# EAGLE design MJ808 clone - rev.5 - TCAN334 - SN E3 - prod (EAGLE 9.6.2)
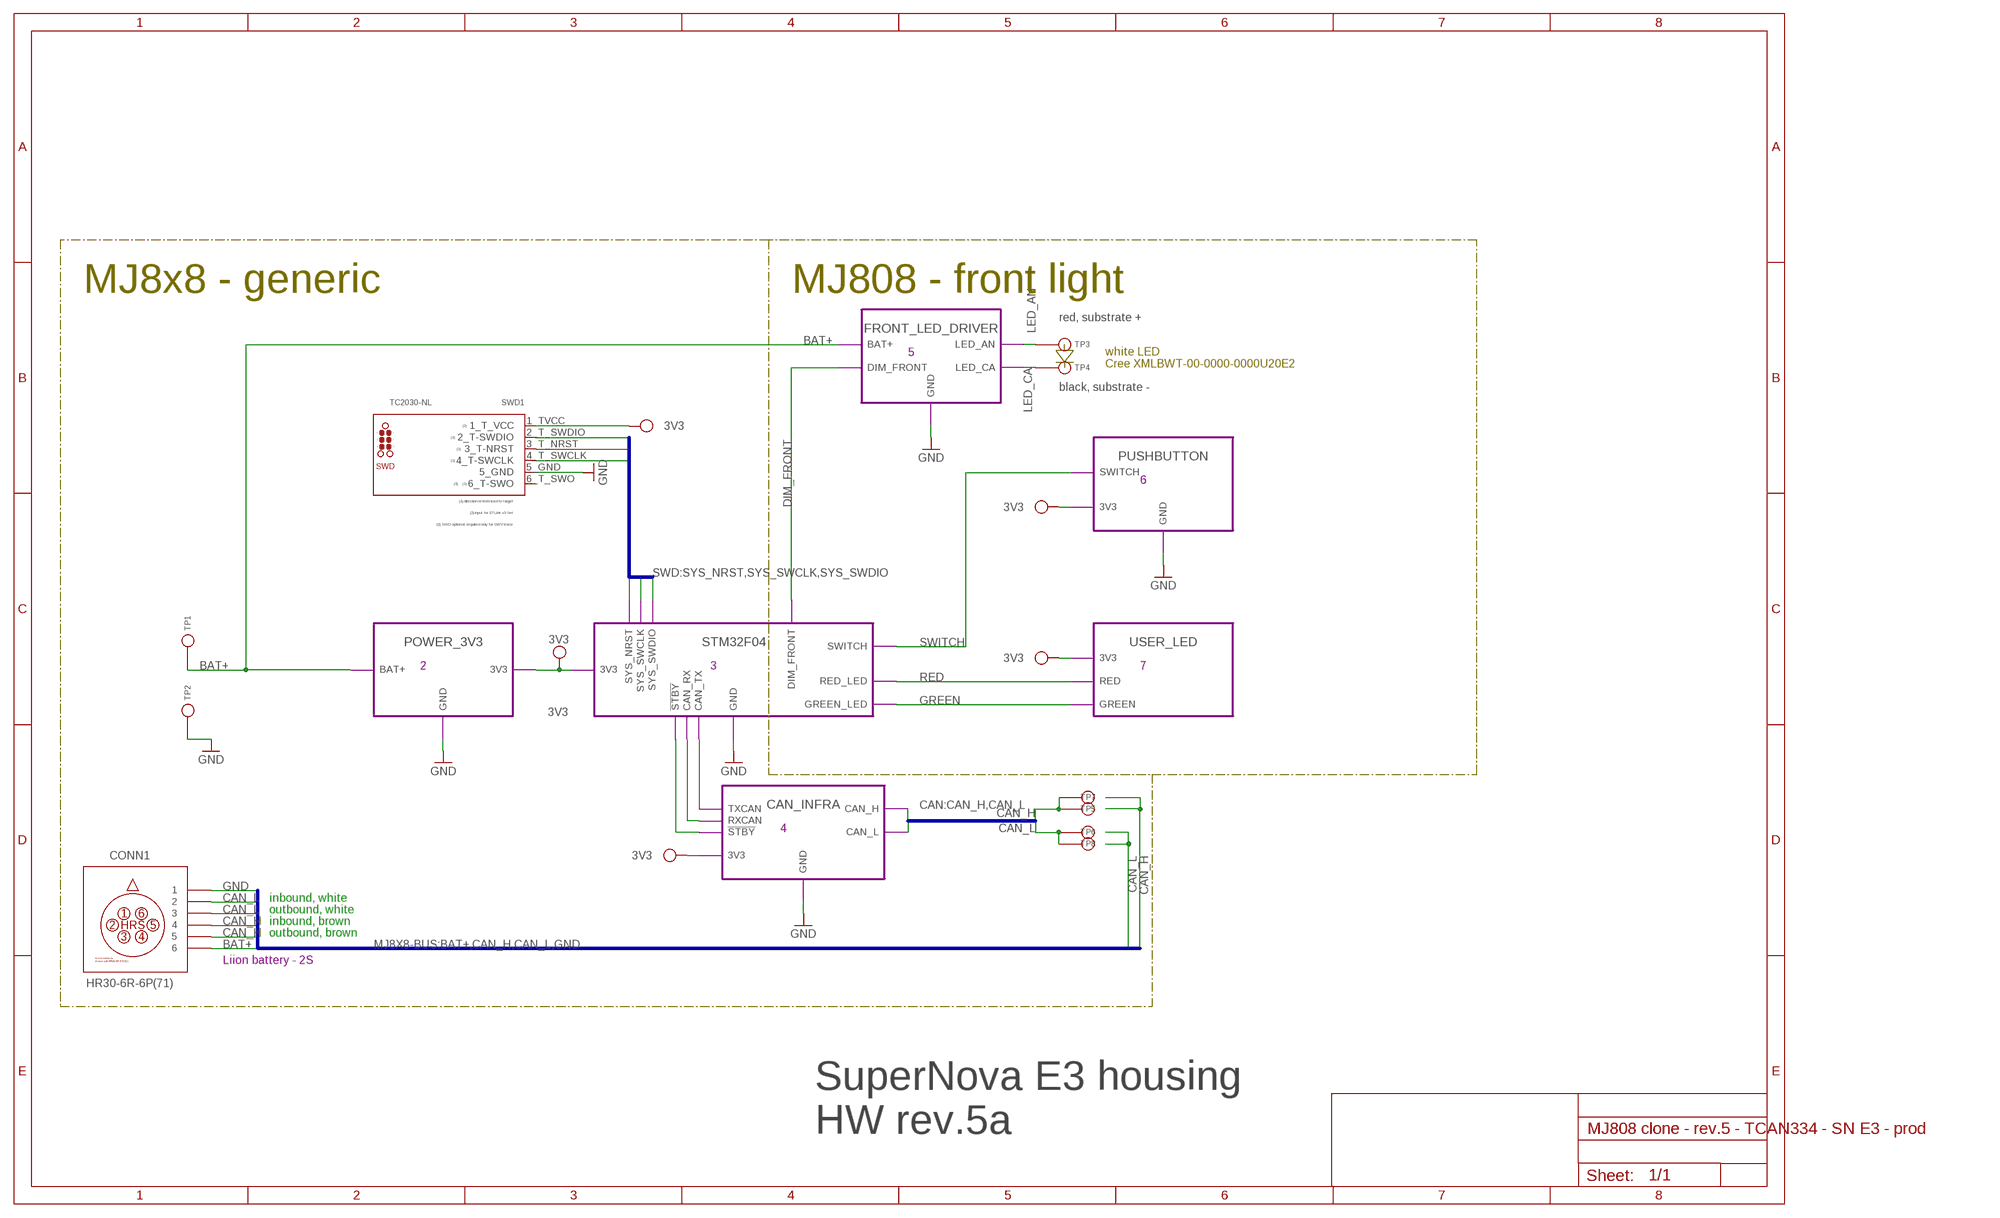
[diagram p0: schematic, sheet 1]

## Parts
CONN1  HR30-6R-6P(71)  HR-30-6R-6X  (no package)
SWD1  TC2030-NL  TC2030  [TC2030-NL]
TP1  LiIon + Terminal  TPTH-0.9  [TH-0.9]
TP2  LiIon - Terminal  TPTH-0.9  [TH-0.9]
TP3  LED anode  TPTH-0.9  [TH-0.9]
TP4  LED cathode  TPTH-0.9  [TH-0.9]
TP5  CAN high  TPTH-0.9  [TH-0.9]
TP6  CAN low  TPTH-0.9  [TH-0.9]
TP7  CAN high  TPTH-0.9  [TH-0.9]
TP8  CAN low  TPTH-0.9  [TH-0.9]

## Module instances
POWER_3V3 = POWER_3V3 (part numbers offset by 200)
STM32F04 = STM32 (part numbers offset by 300)
CAN_INFRA = CAN_INFRA (part numbers offset by 400)
FRONT_LED_DRIVER = LED_DRIVER_FRONT (part numbers offset by 500)
PUSHBUTTON = PUSHBUTTON (part numbers offset by 600)
USER_LED = USER_LED (part numbers offset by 700)

## Nets
3V3 [3V3]: SWD1.1_TVCC(1_T_VCC) ; port STM32F04.3V3 POWER_3V3.3V3 CAN_INFRA.3V3 PUSHBUTTON.3V3 USER_LED.3V3
!STBY! [signal]: port CAN_INFRA.!STBY! STM32F04.!STBY!
BAT+ [BAT+]: CONN1.6 TP1.P$1(TP$1) ; port POWER_3V3.BAT+ FRONT_LED_DRIVER.BAT+
CAN_H [signal]: CONN1.4 CONN1.5 TP5.P$1(TP$1) TP7.P$1(TP$1) ; port CAN_INFRA.CAN_H
CAN_L [signal]: CONN1.2 CONN1.3 TP6.P$1(TP$1) TP8.P$1(TP$1) ; port CAN_INFRA.CAN_L
CAN_RX [signal]: port CAN_INFRA.RXCAN STM32F04.CAN_RX
CAN_TX [signal]: port CAN_INFRA.TXCAN STM32F04.CAN_TX
DIM_FRONT [signal]: port STM32F04.DIM_FRONT FRONT_LED_DRIVER.DIM_FRONT
GND: CONN1.1 SWD1.5_GND TP2.P$1(TP$1) ; port STM32F04.GND POWER_3V3.GND CAN_INFRA.GND FRONT_LED_DRIVER.GND PUSHBUTTON.GND
GREEN [3V3]: port STM32F04.GREEN_LED USER_LED.GREEN
LED_AN [BAT+]: TP3.P$1(TP$1) ; port FRONT_LED_DRIVER.LED_AN
LED_CA [BAT+]: TP4.P$1(TP$1) ; port FRONT_LED_DRIVER.LED_CA
RED [3V3]: port STM32F04.RED_LED USER_LED.RED
SWITCH [signal]: port STM32F04.SWITCH PUSHBUTTON.SWITCH
SYS_NRST [signal]: SWD1.3_T_NRST(3_T-NRST) ; port STM32F04.SYS_NRST
SYS_SWCLK [signal]: SWD1.4_T_SWCLK(4_T-SWCLK) ; port STM32F04.SYS_SWCLK
SYS_SWDIO [signal]: SWD1.2_T_SWDIO(2_T-SWDIO) ; port STM32F04.SYS_SWDIO
Unconnected: SWD1.6_T_SWO(6_T-SWO)

## Buses
CAN:CAN_H,CAN_L
SWD:SYS_NRST,SYS_SWCLK,SYS_SWDIO
MJ8X8-BUS:BAT+,CAN_H,CAN_L,GND

## Notes on the sheet
- MJ8x8 - generic | MJ808 - front light
- red, substrate +
- 5
- white LED
  Cree XMLBWT-00-0000-0000U20E2
- black, substrate -
- 6
- 2 | 3 | 7
- 4
- inbound, white
- outbound, white
- inbound, brown
- outbound, brown
- Liion battery - 2S
- SuperNova E3 housing
  HW rev.5a

## Library data of the parts
CONN1 = HR30-6R-6P - PushPull Receptacle:HR-30-6R-6X
SWD1 = tag-connect:TC2030: TC2030 pad no. Function STLink v3 CN1 pin no. Function 1 Reserved (1) 2 Reserved (1) 1 T_Vcc 3 T_Vcc (2) 2 T_SWDIO 4 T_JTMS/T_SWDIO 5 GND 4 T_SWCLK 6 T_JCLK / T_SWCLK 5 GND 7 GND 6 8 T_JTDO / T_SWO (3) 9 T_JRCLK (4) / NC (5) 10 T_JTDI / NC (5) 11 GNDDetect (6) 3 T_NRST 12 T_NRST 13 T_VCP_RX (7) 14 T_VCP_TX (2) (1) Do not connect to the target (2) Input for STLINK-V3SET (3) SWO is optional, required only for Serial Wire Viewer (SWV) trace (4) Optional loopback of T_JCLK on the target side, required if loopback is removed on the STLINK-V3SET side (5) NC means not required for the SWD connection (6) Tied to GND by STLINK-V3SET firmware; may be used by the target for detection of the tool (7) Output for STLINK-V3SET
TP1-TP8 = signal testpoint:TP

## Module POWER_3V3
Ports: GND(pwr) BAT+(pwr) 3V3(pwr)
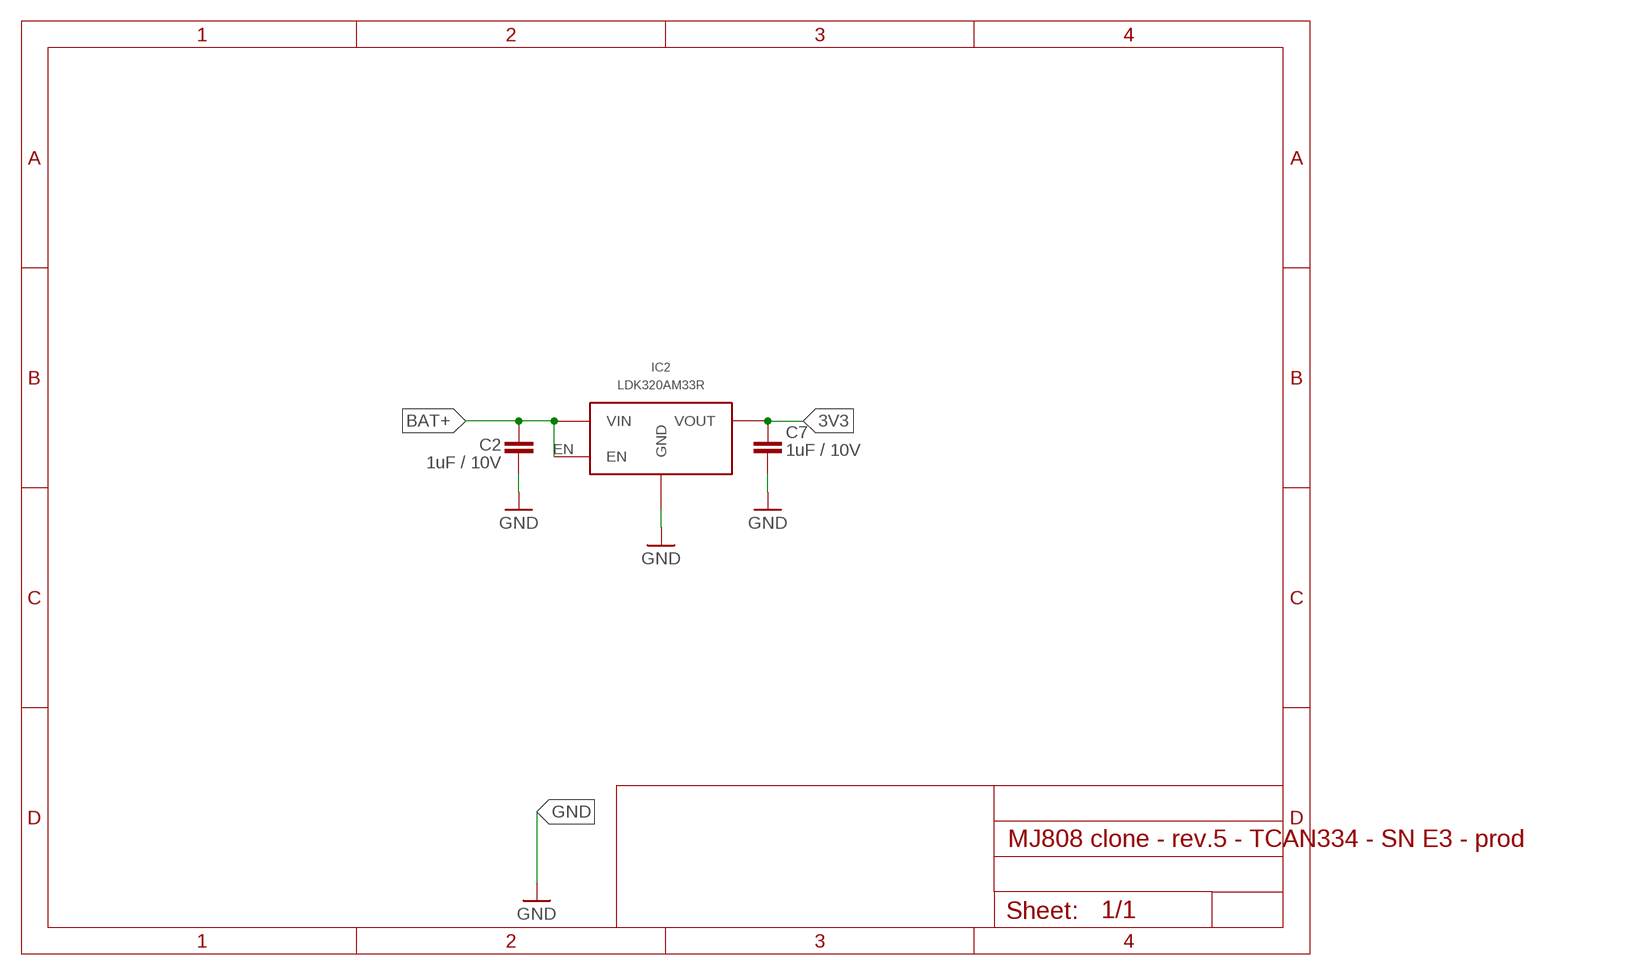
[diagram p1: schematic, module POWER_3V3, sheet 1]

### Parts
C2  1uF / 10V  C-EUC0402  [C0402]
C7  1uF / 10V  C-EUC0402  [C0402]
IC2  LDK320AM33R  LDK320SOT-23-5L  [SOT-23-5L]

### Nets
3V3 [3V3]: C7.2 IC2.OUT(VOUT)
BAT+ [BAT+]: C2.1 IC2.EN IC2.IN(VIN)
GND: C2.2 C7.1 IC2.GND

### Library data of the parts
C2 C7 = rcl:C-EU: CAPACITOR, European symbol; SPICEPREFIX: C
IC2 = LDK320 5V LDO:LDK320

## Module STM32
Ports: GND(pwr) 3V3(pwr) SYS_NRST(in) SYS_SWCLK(io) SYS_SWDIO(io) CAN_RX(in) CAN_TX(out) !STBY!(out) SWITCH(in) GREEN_LED(hiz) RED_LED(hiz) DIM_FRONT(out)
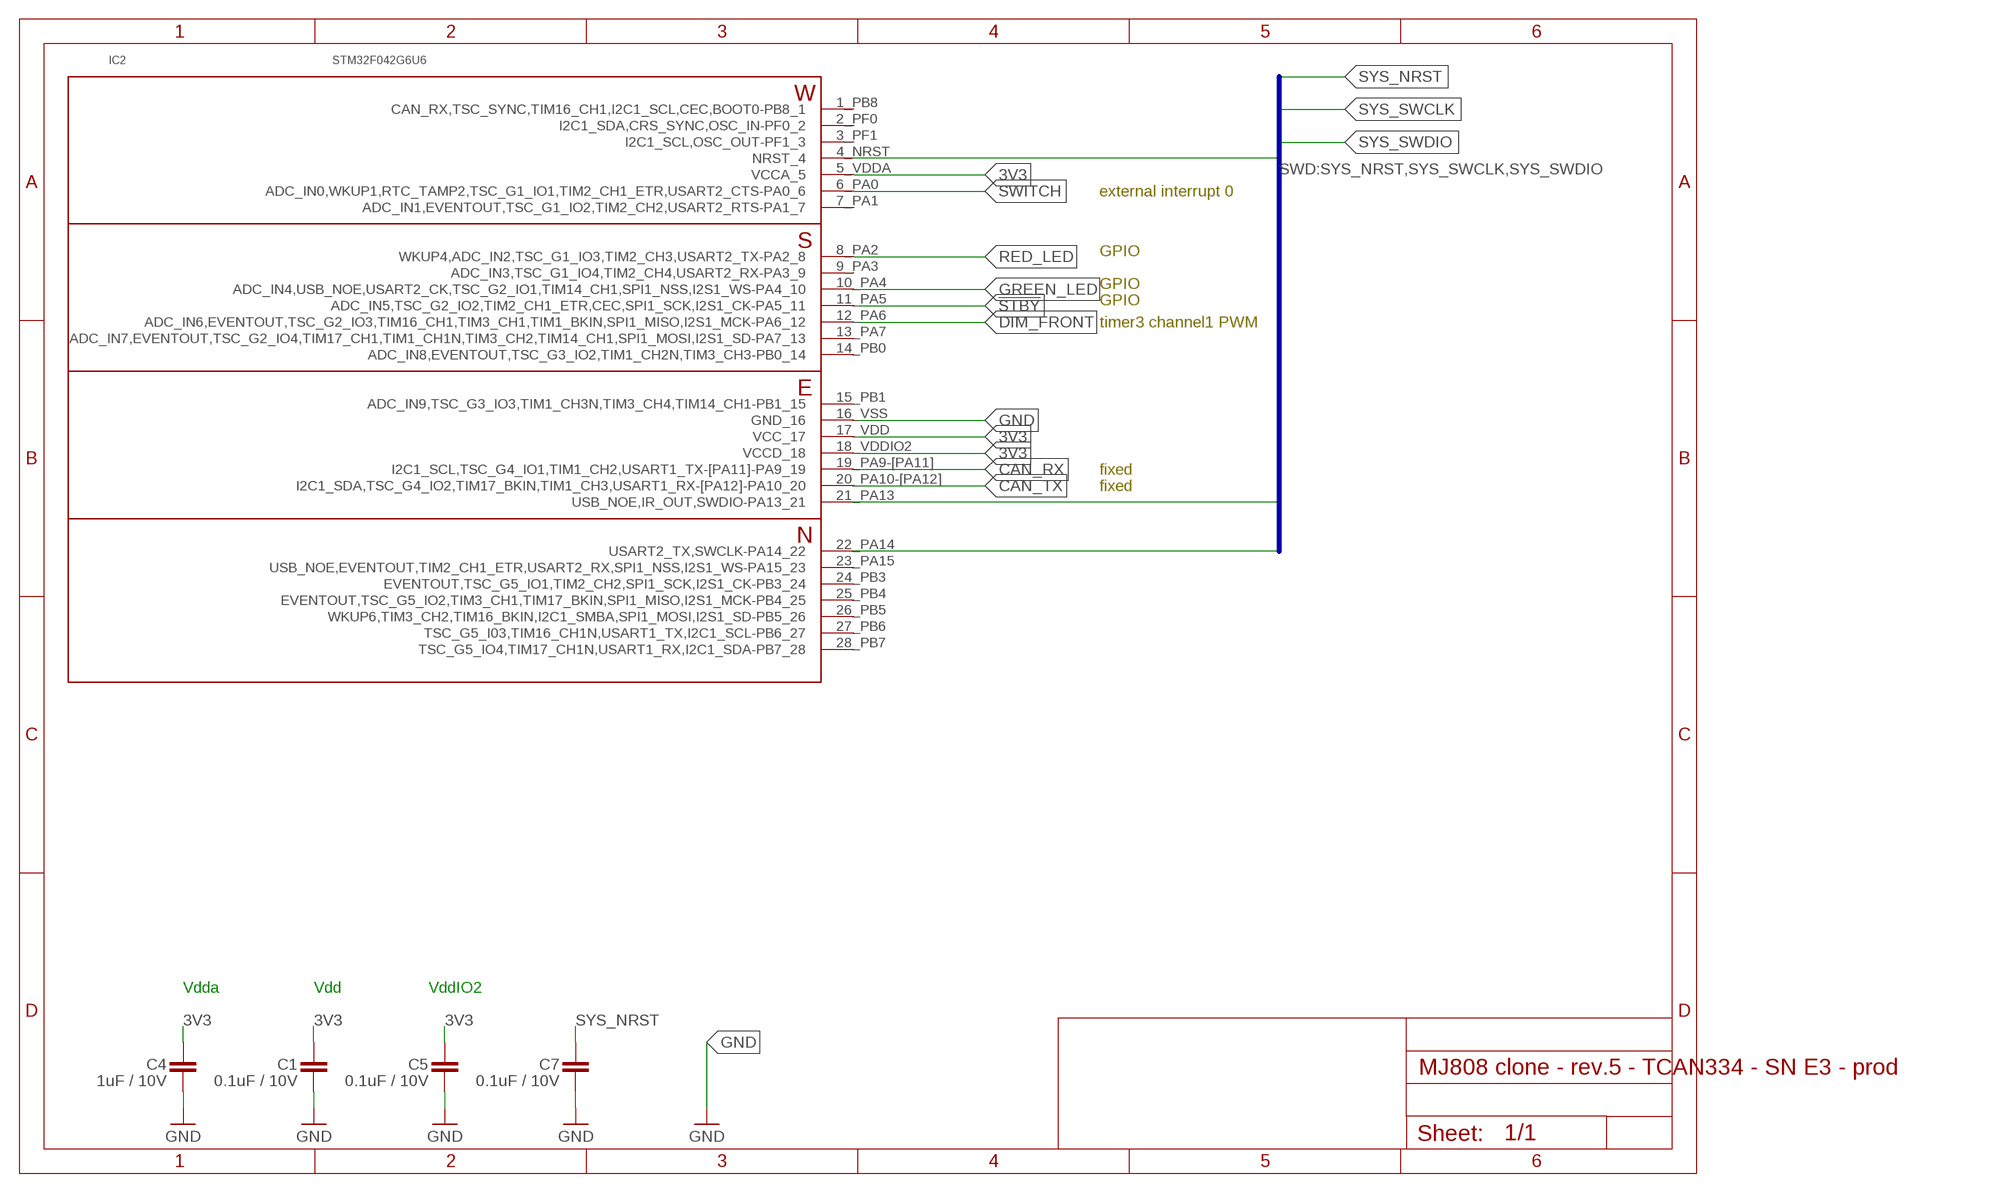
[diagram p2: schematic, module STM32, sheet 1]

### Parts
C1  0.1uF / 10V  C-EUC0402  [C0402]
C4  1uF / 10V  C-EUC0402  [C0402]
C5  0.1uF / 10V  C-EUC0402  [C0402]
C7  0.1uF / 10V  C-EUC0402  [C0402]
IC2  STM32F042G6U6  STM32F042G6  [UFQFPN-28]

### Nets
3V3 [3V3]: C1.2 C4.2 C5.2 IC2.5_VDDA(VCCA_5) IC2.17_VDD(VCC_17) IC2.18_VDDIO2(VCCD_18)
!STBY!: IC2.11_PA5(ADC_IN5,TSC_G2_IO2,TIM2_CH1_ETR,CEC,SPI1_SCK,I2S1_CK-PA5_11)
CAN_RX: IC2.19_PA9-[PA11](I2C1_SCL,TSC_G4_IO1,TIM1_CH2,USART1_TX-[PA11]-PA9_19)
CAN_TX: IC2.20_PA10-[PA12](I2C1_SDA,TSC_G4_IO2,TIM17_BKIN,TIM1_CH3,USART1_RX-[PA12]-PA10_20)
DIM_FRONT: IC2.12_PA6(ADC_IN6,EVENTOUT,TSC_G2_IO3,TIM16_CH1,TIM3_CH1,TIM1_BKIN,SPI1_MISO,I2S1_MCK-PA6_12)
GND: C1.1 C4.1 C5.1 C7.1 IC2.16_VSS(GND_16)
GREEN_LED [3V3]: IC2.10_PA4(ADC_IN4,USB_NOE,USART2_CK,TSC_G2_IO1,TIM14_CH1,SPI1_NSS,I2S1_WS-PA4_10)
RED_LED [3V3]: IC2.8_PA2(WKUP4,ADC_IN2,TSC_G1_IO3,TIM2_CH3,USART2_TX-PA2_8)
SWITCH: IC2.6_PA0(ADC_IN0,WKUP1,RTC_TAMP2,TSC_G1_IO1,TIM2_CH1_ETR,USART2_CTS-PA0_6)
SYS_NRST: C7.2 IC2.4_NRST(NRST_4)
SYS_SWCLK: IC2.22_PA14(USART2_TX,SWCLK-PA14_22)
SYS_SWDIO: IC2.21_PA13(USB_NOE,IR_OUT,SWDIO-PA13_21)
Unconnected: IC2.1_PB8(CAN_RX,TSC_SYNC,TIM16_CH1,I2C1_SCL,CEC,BOOT0-PB8_1) IC2.2_PF0(I2C1_SDA,CRS_SYNC,OSC_IN-PF0_2) IC2.3_PF1(I2C1_SCL,OSC_OUT-PF1_3) IC2.7_PA1(ADC_IN1,EVENTOUT,TSC_G1_IO2,TIM2_CH2,USART2_RTS-PA1_7) IC2.9_PA3(ADC_IN3,TSC_G1_IO4,TIM2_CH4,USART2_RX-PA3_9) IC2.13_PA7(ADC_IN7,EVENTOUT,TSC_G2_IO4,TIM17_CH1,TIM1_CH1N,TIM3_CH2,TIM14_CH1,SPI1_MOSI,I2S1_SD-PA7_13) IC2.14_PB0(ADC_IN8,EVENTOUT,TSC_G3_IO2,TIM1_CH2N,TIM3_CH3-PB0_14) IC2.15_PB1(ADC_IN9,TSC_G3_IO3,TIM1_CH3N,TIM3_CH4,TIM14_CH1-PB1_15) IC2.23_PA15(USB_NOE,EVENTOUT,TIM2_CH1_ETR,USART2_RX,SPI1_NSS,I2S1_WS-PA15_23) IC2.24_PB3(EVENTOUT,TSC_G5_IO1,TIM2_CH2,SPI1_SCK,I2S1_CK-PB3_24) IC2.25_PB4(EVENTOUT,TSC_G5_IO2,TIM3_CH1,TIM17_BKIN,SPI1_MISO,I2S1_MCK-PB4_25) IC2.26_PB5(WKUP6,TIM3_CH2,TIM16_BKIN,I2C1_SMBA,SPI1_MOSI,I2S1_SD-PB5_26) IC2.27_PB6(TSC_G5_I03,TIM16_CH1N,USART1_TX,I2C1_SCL-PB6_27) IC2.28_PB7(TSC_G5_IO4,TIM17_CH1N,USART1_RX,I2C1_SDA-PB7_28)

### Buses
SWD:SYS_NRST,SYS_SWCLK,SYS_SWDIO

### Notes on the sheet
- external interrupt 0
- GPIO
- GPIO
- GPIO
- timer3 channel1 PWM
- fixed
- fixed
- Vdda | Vdd | VddIO2

### Library data of the parts
C1 C4 C5 C7 = rcl:C-EU: CAPACITOR, European symbol; SPICEPREFIX: C
IC2 = STM32F042G6:STM32F042G6

## Module CAN_INFRA
Ports: GND(pwr) 3V3(pwr) CAN_H(io) CAN_L(io) TXCAN(in) RXCAN(out) !STBY!(in)
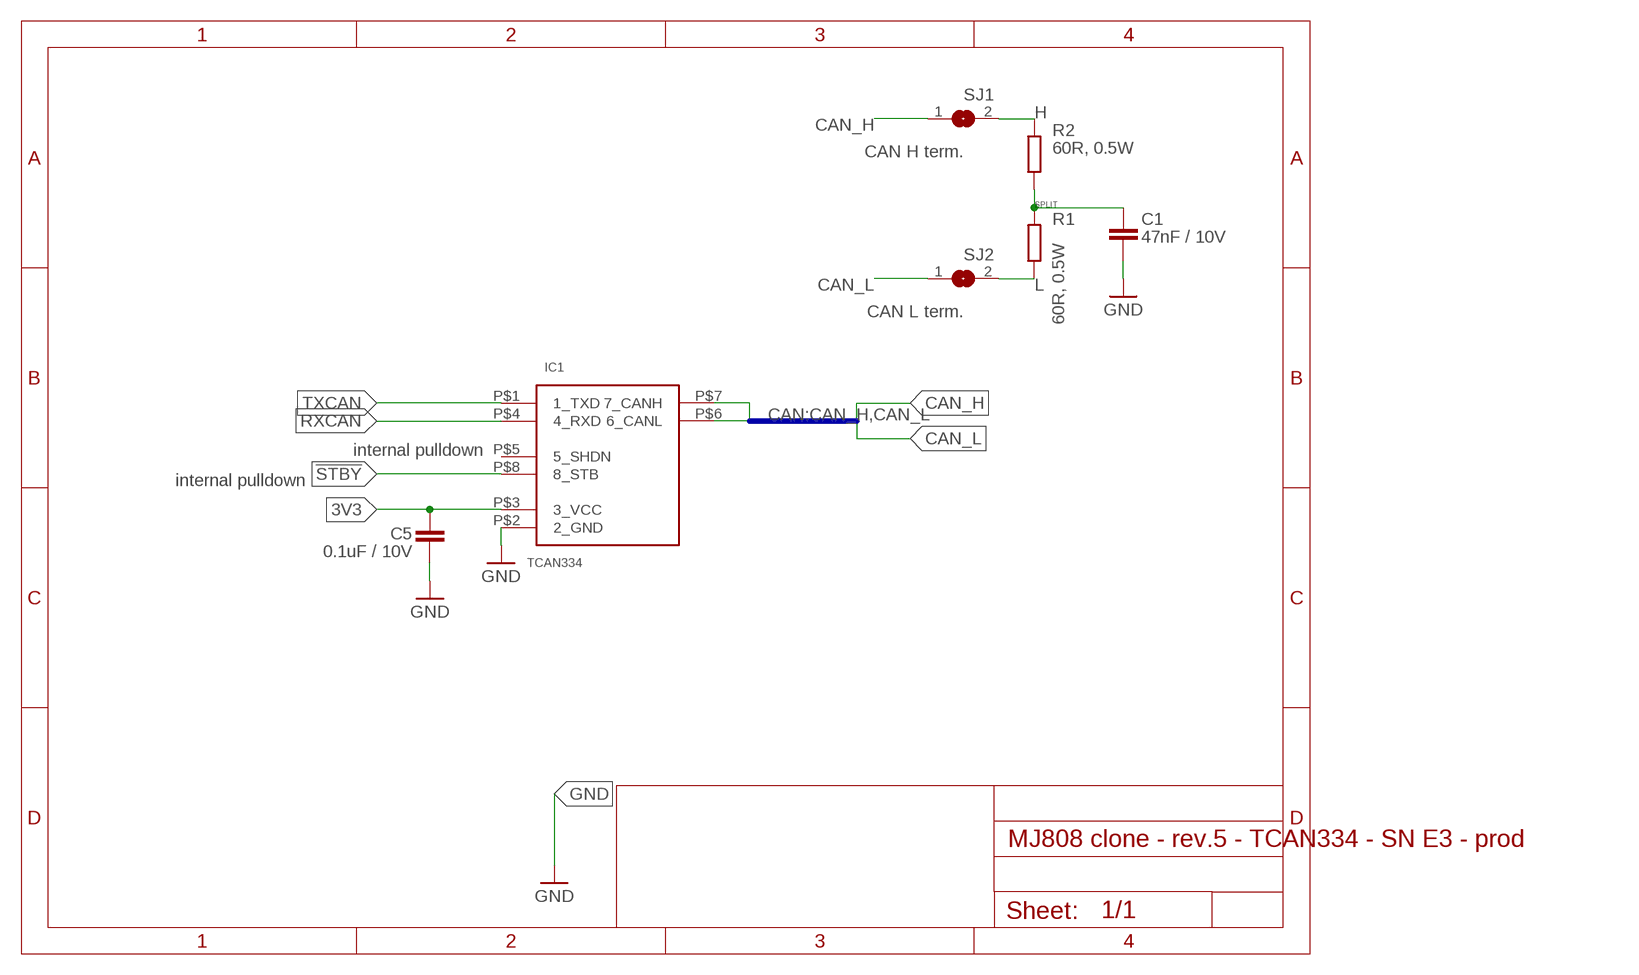
[diagram p3: schematic, module CAN_INFRA, sheet 1]

### Parts
C1  47nF / 10V  C-EUC0402  [C0402]
C5  0.1uF / 10V  C-EUC0402  [C0402]
IC1  TCAN334  CAN33X  [SOT23-8]
R1  60R, 0.5W  R-EU_R0805  [R0805]
R2  60R, 0.5W  R-EU_R0805  [R0805]
SJ1  CAN H term.  SJ  [SJ]
SJ2  CAN L term.  SJ  [SJ]

### Nets
3V3 [3V3]: C5.1 IC1.P$3(3_VCC)
!STBY! [signal]: IC1.P$8(8_STB)
CAN_H: IC1.P$7(7_CANH) SJ1.1
CAN_L: IC1.P$6(6_CANL) SJ2.1
GND: C1.2 C5.2 IC1.P$2(2_GND)
H: R2.2 SJ1.2
L: R1.1 SJ2.2
RXCAN [signal]: IC1.P$4(4_RXD)
SPLIT [signal]: C1.1 R1.2 R2.1
TXCAN [signal]: IC1.P$1(1_TXD)
Unconnected: IC1.P$5(5_SHDN)

### Buses
CAN:CAN_H,CAN_L

### Notes on the sheet
- internal pulldown
- internal pulldown

### Library data of the parts
C1 C5 = rcl:C-EU: CAPACITOR, European symbol; SPICEPREFIX: C
IC1 = TCAN33x - 3.3V CAN Transciever:CAN33X
R1 R2 = rcl:R-EU_: RESISTOR, European symbol; SPICEPREFIX: R
SJ1 SJ2 = jumper:SJ: SMD solder JUMPER

## Module LED_DRIVER_FRONT
Ports: GND(pwr) LED_AN(pwr) LED_CA(pwr) DIM_FRONT(in) BAT+(pwr)
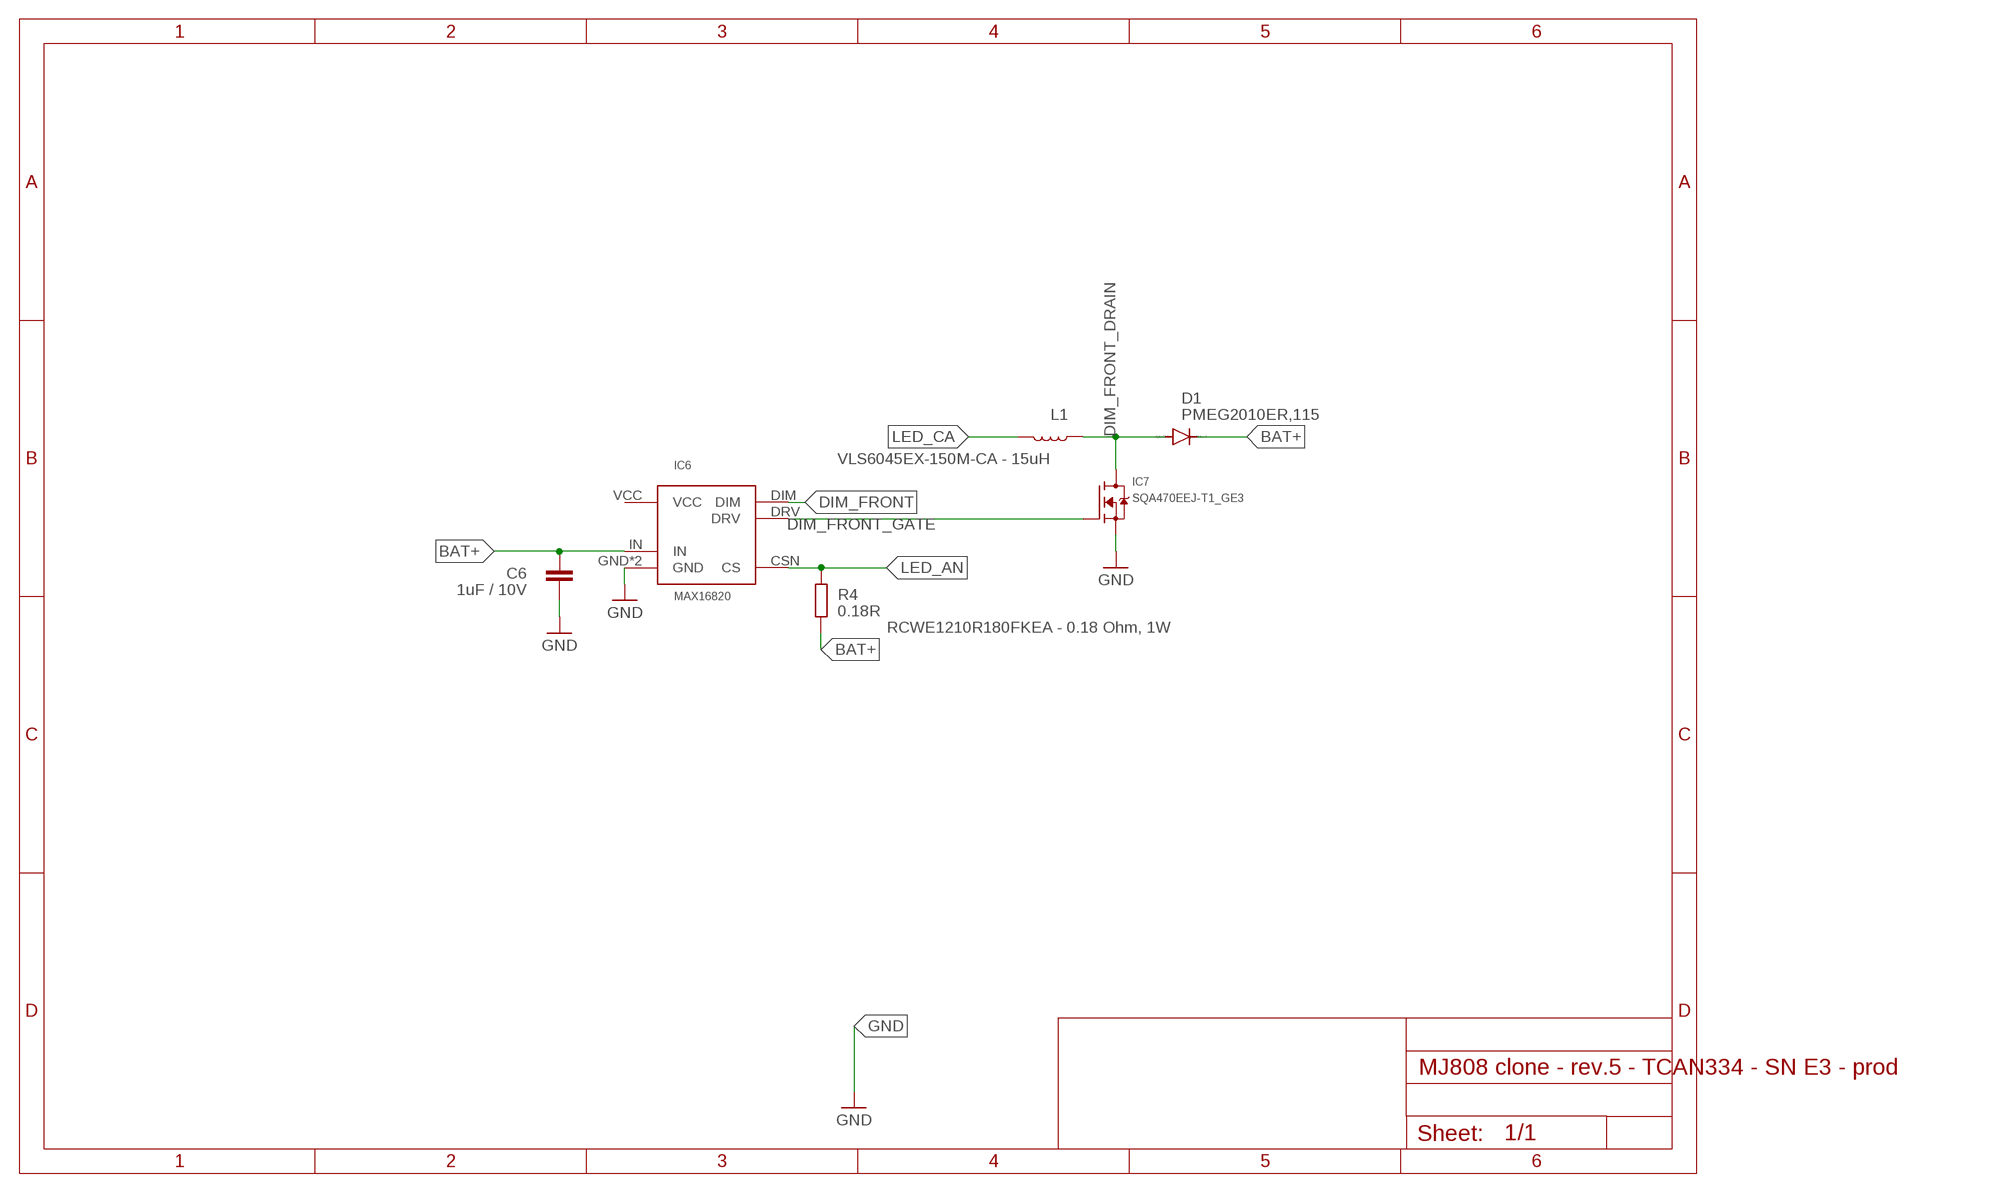
[diagram p4: schematic, module LED_DRIVER_FRONT, sheet 1]

### Parts
C6  1uF / 10V  C-EUC0402  [C0402]
D1  PMEG2010ER,115  DIODE-SOD123  [SOD123]
IC6  MAX16820  [TDFN-6-EP]
IC7  SQA470EEJ-T1_GE3  SIA456DJ  [SC-70-6]
L1  VLS6045EX-150M-CA - 15uH  INDUCTOR-SRN6045-33UH  [SRN6045]
R4  0.18R  R-EU_R2010  [R2010]

### Nets
BAT+ [BAT+]: C6.1 D1.C IC6.IN R4.2
DIM_FRONT [signal]: IC6.DIM
DIM_FRONT_DRAIN [signal]: D1.A IC7.1D(D) IC7.2D(D) IC7.5D(D) IC7.6D(D) IC7.D L1.1
DIM_FRONT_GATE [signal]: IC6.DRV IC7.3G(G)
GND: C6.2 IC6.GND IC6.GND1(GND) IC7.4S(S) IC7.S
LED_AN [BAT+]: IC6.CSN(CS) R4.1
LED_CA [BAT+]: L1.2

### Notes on the sheet
- RCWE1210R180FKEA - 0.18 Ohm, 1W

### Power pins joined to a net without a drawn wire
VCC: IC6.VCC

### Library data of the parts
C6 = rcl:C-EU: CAPACITOR, European symbol; SPICEPREFIX: C
D1 = diode:DIODE-: DIODE
IC6 = MAX16820 LED Driver, constant current:MAX16820
IC7 = SIA456DJ-T1-GE3  N-Fet:SIA456DJ
L1 = SparkFun-Coils:INDUCTOR: Inductors Resist changes in electrical current. Basically a coil of wire. SparkFun Products: SparkFun Load Cell Amplifier - HX711 <https://www.sparkfun.com/products/13879> IOIO-OTG - V2.2 <https://www.sparkfun.com/products/13613>; PROD_ID: NDUC-11627; VALUE: 33µH/±20%/1.4A
R4 = rcl:R-EU_: RESISTOR, European symbol; SPICEPREFIX: R

## Module PUSHBUTTON
Ports: SWITCH(out) GND(pwr) 3V3(pwr)
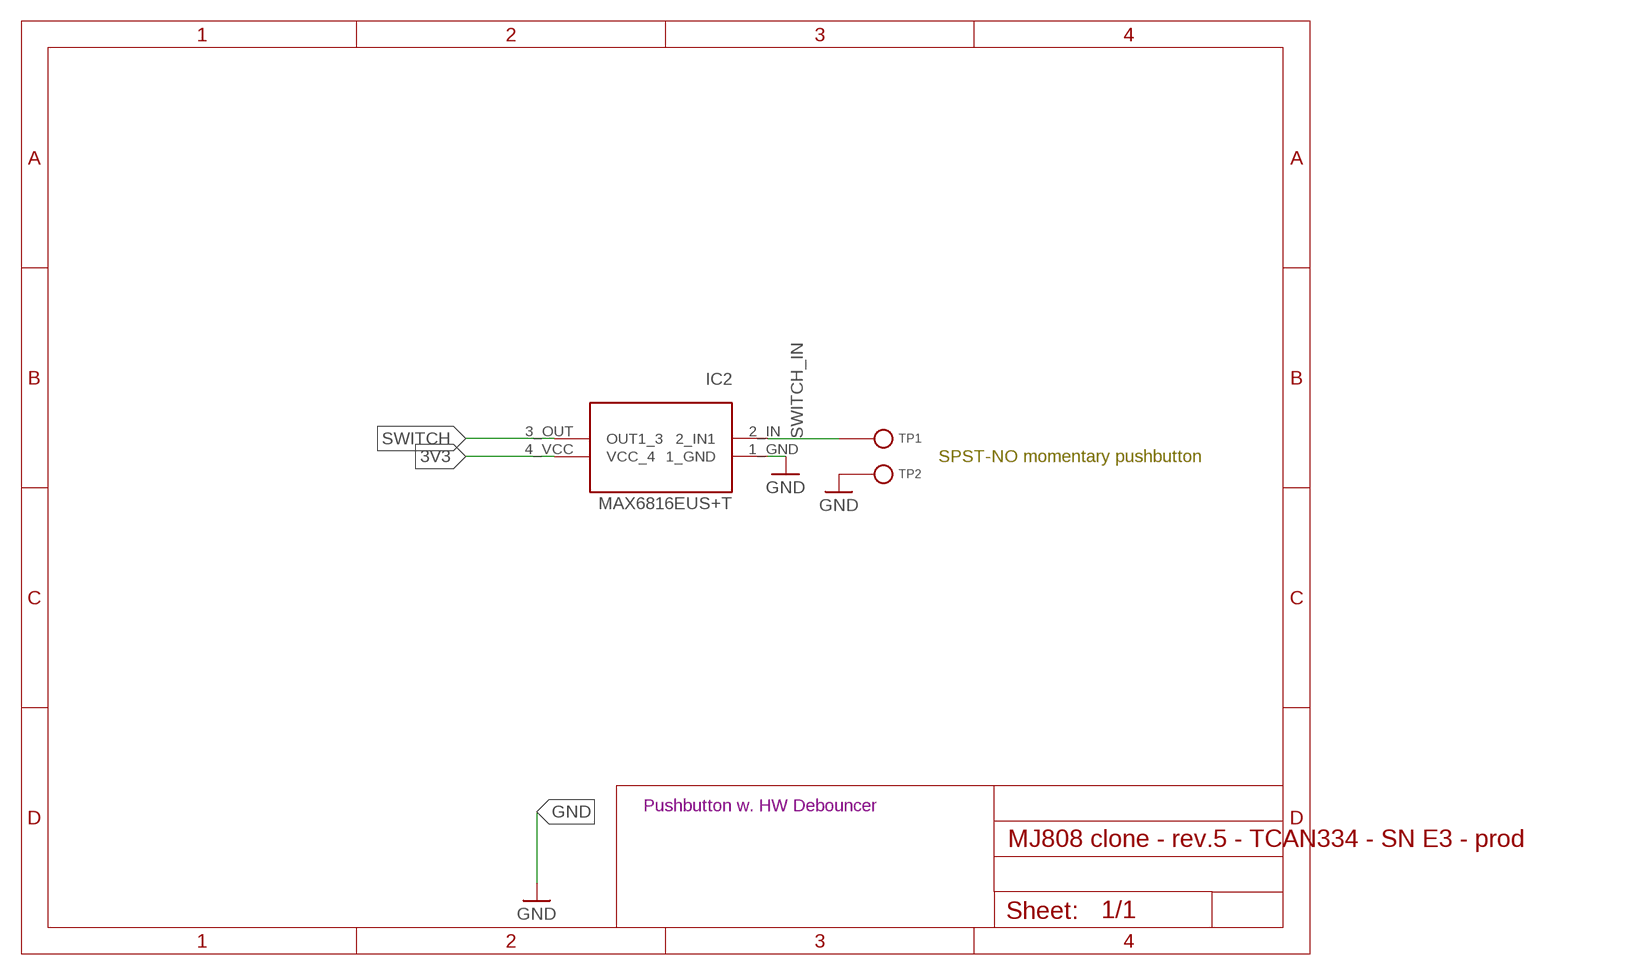
[diagram p5: schematic, module PUSHBUTTON, sheet 1]

### Parts
IC2  MAX6816EUS+T  MAX6816  [4SOT143]
TP1  LED anode  TPTH-0.9  [TH-0.9]
TP2  LED anode  TPTH-0.9  [TH-0.9]

### Nets
3V3: IC2.4_VCC(VCC_4)
GND: IC2.1_GND TP2.P$1(TP$1)
SWITCH: IC2.3_OUT(OUT1_3)
SWITCH_IN [3V3]: IC2.2_IN(2_IN1) TP1.P$1(TP$1)

### Notes on the sheet
- SPST-NO momentary pushbutton
- Pushbutton w. HW Debouncer

### Library data of the parts
IC2 = MAX6818 CMOS Switch debouncer:MAX6816
TP1 TP2 = signal testpoint:TP

## Module USER_LED
Ports: 3V3(pwr) GREEN(hiz) RED(hiz)
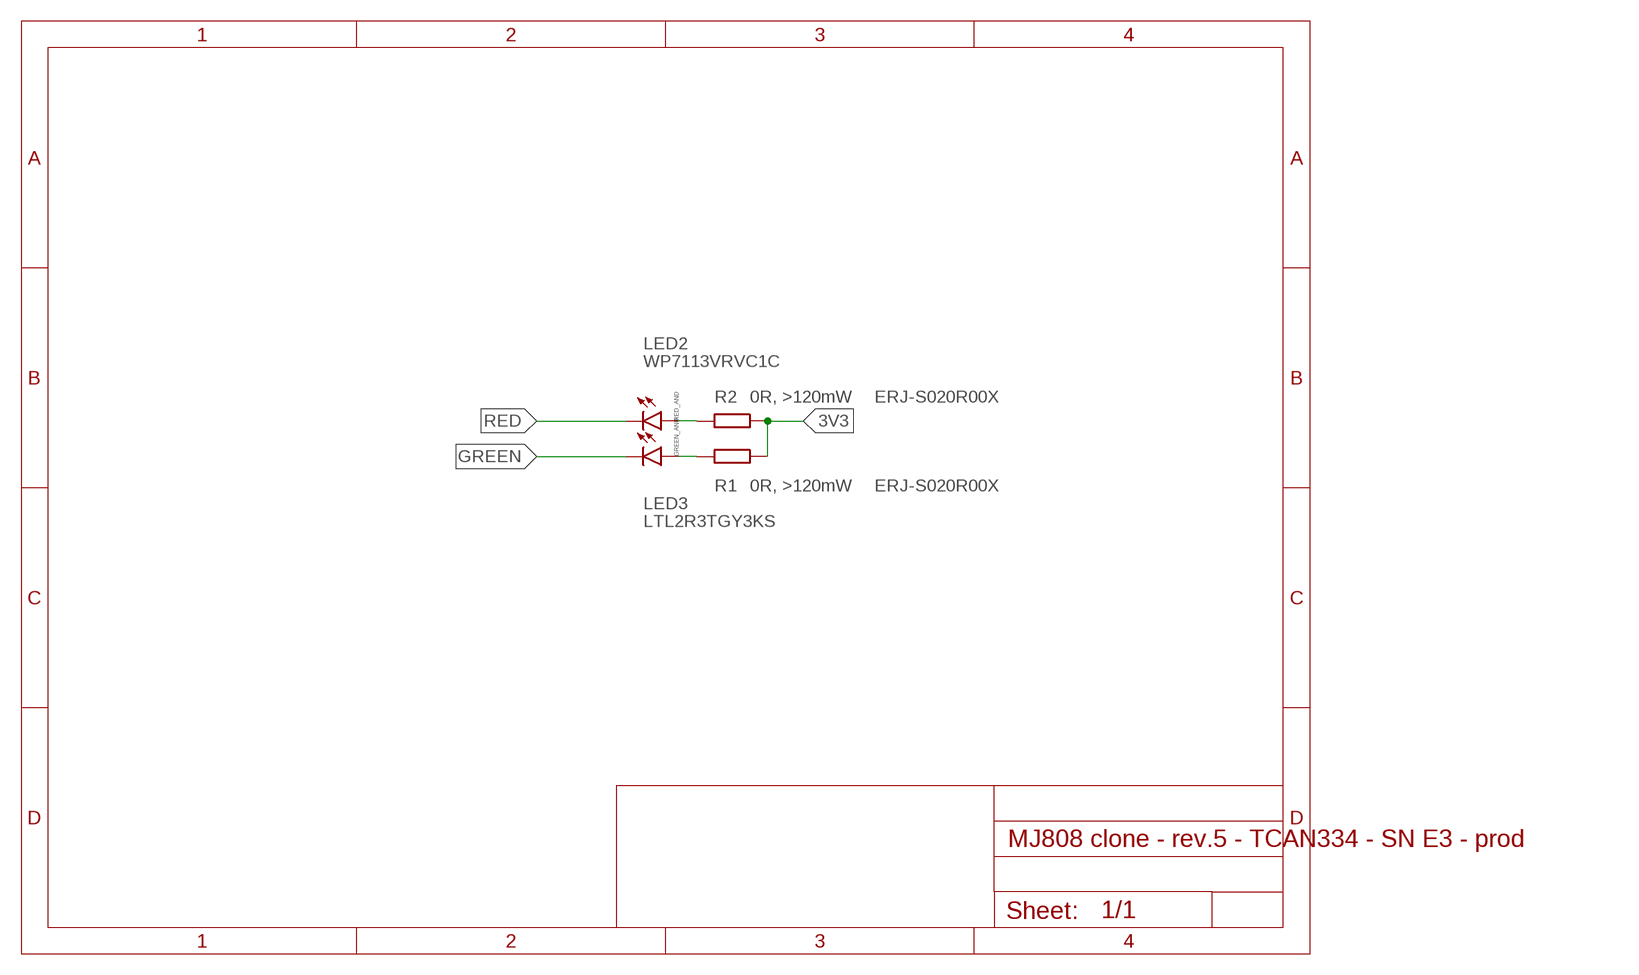
[diagram p6: schematic, module USER_LED, sheet 1]

### Parts
LED2  WP7113VRVC1C  LED  [TH]
LED3  LTL2R3TGY3KS  LED  [TH]
R1  0R, >120mW  R-EU_R0402  [R0402]
R2  0R, >120mW  R-EU_R0402  [R0402]

### Nets
3V3 [3V3]: R1.1 R2.1
GREEN [3V3]: LED3.CAT
GREEN_AND [signal]: LED3.AND R1.2
RED [3V3]: LED2.CAT
RED_AND [signal]: LED2.AND R2.2

### Notes on the sheet
- ERJ-S020R00X
- ERJ-S020R00X

### Library data of the parts
LED2 LED3 = TH LED:LED
R1 R2 = rcl:R-EU_: RESISTOR, European symbol; SPICEPREFIX: R

## Net classes
0 GND: width 0.25 mm, drill 0.35 mm, clearance 0.19 mm
1 BAT+: width 0.5 mm, drill 0.35 mm, clearance 0.19 mm
3 signal: width 0.25 mm, drill 0.35 mm, clearance 0.19 mm
4 3V3: width 0.25 mm, drill 0.35 mm, clearance 0.19 mm

## Board
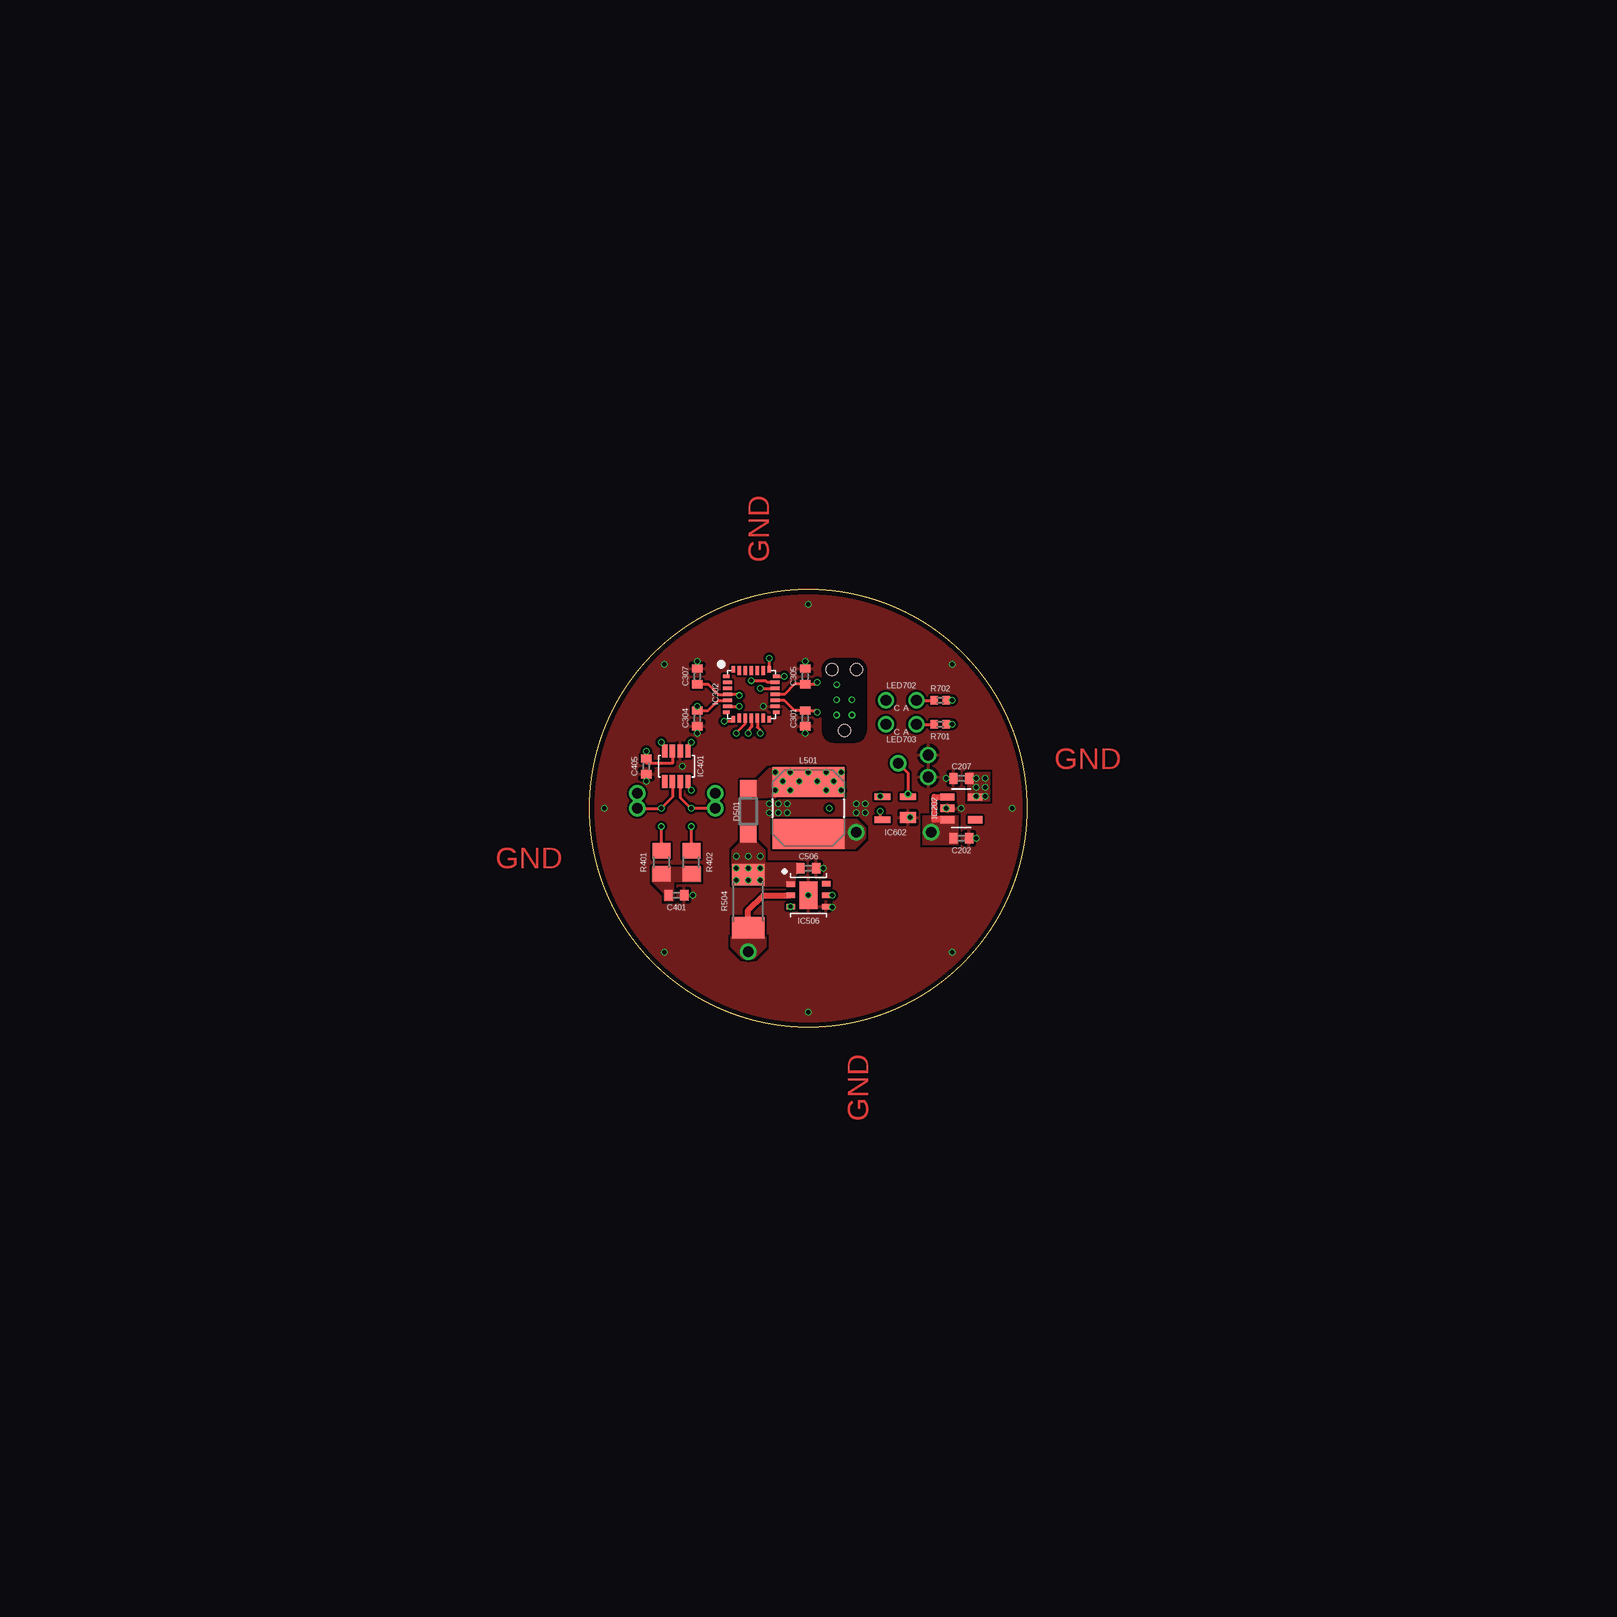
[diagram p7: board, top side]
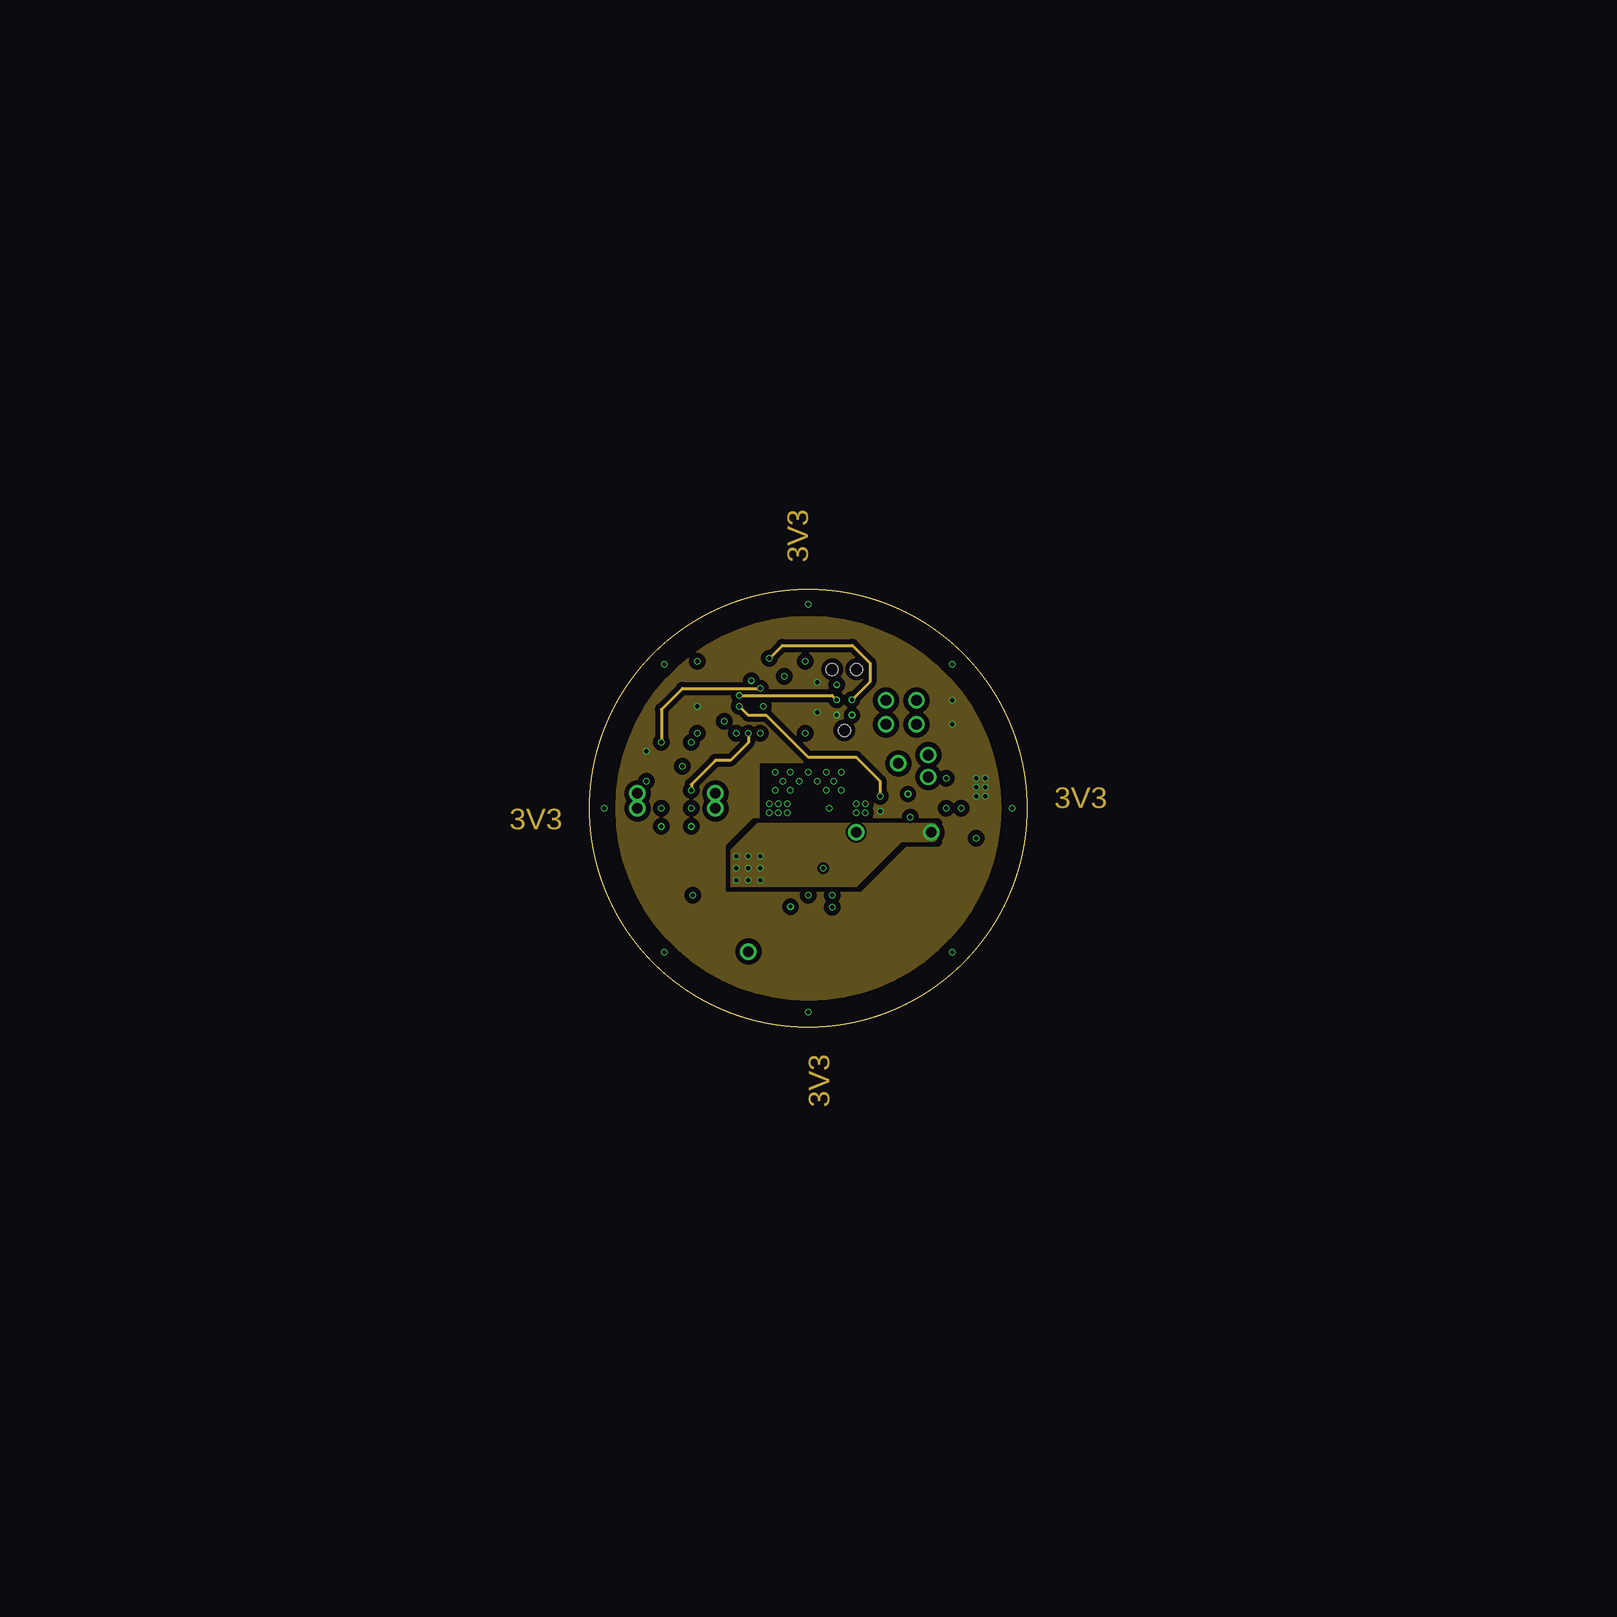
[diagram p8: board, inner layer Route2]
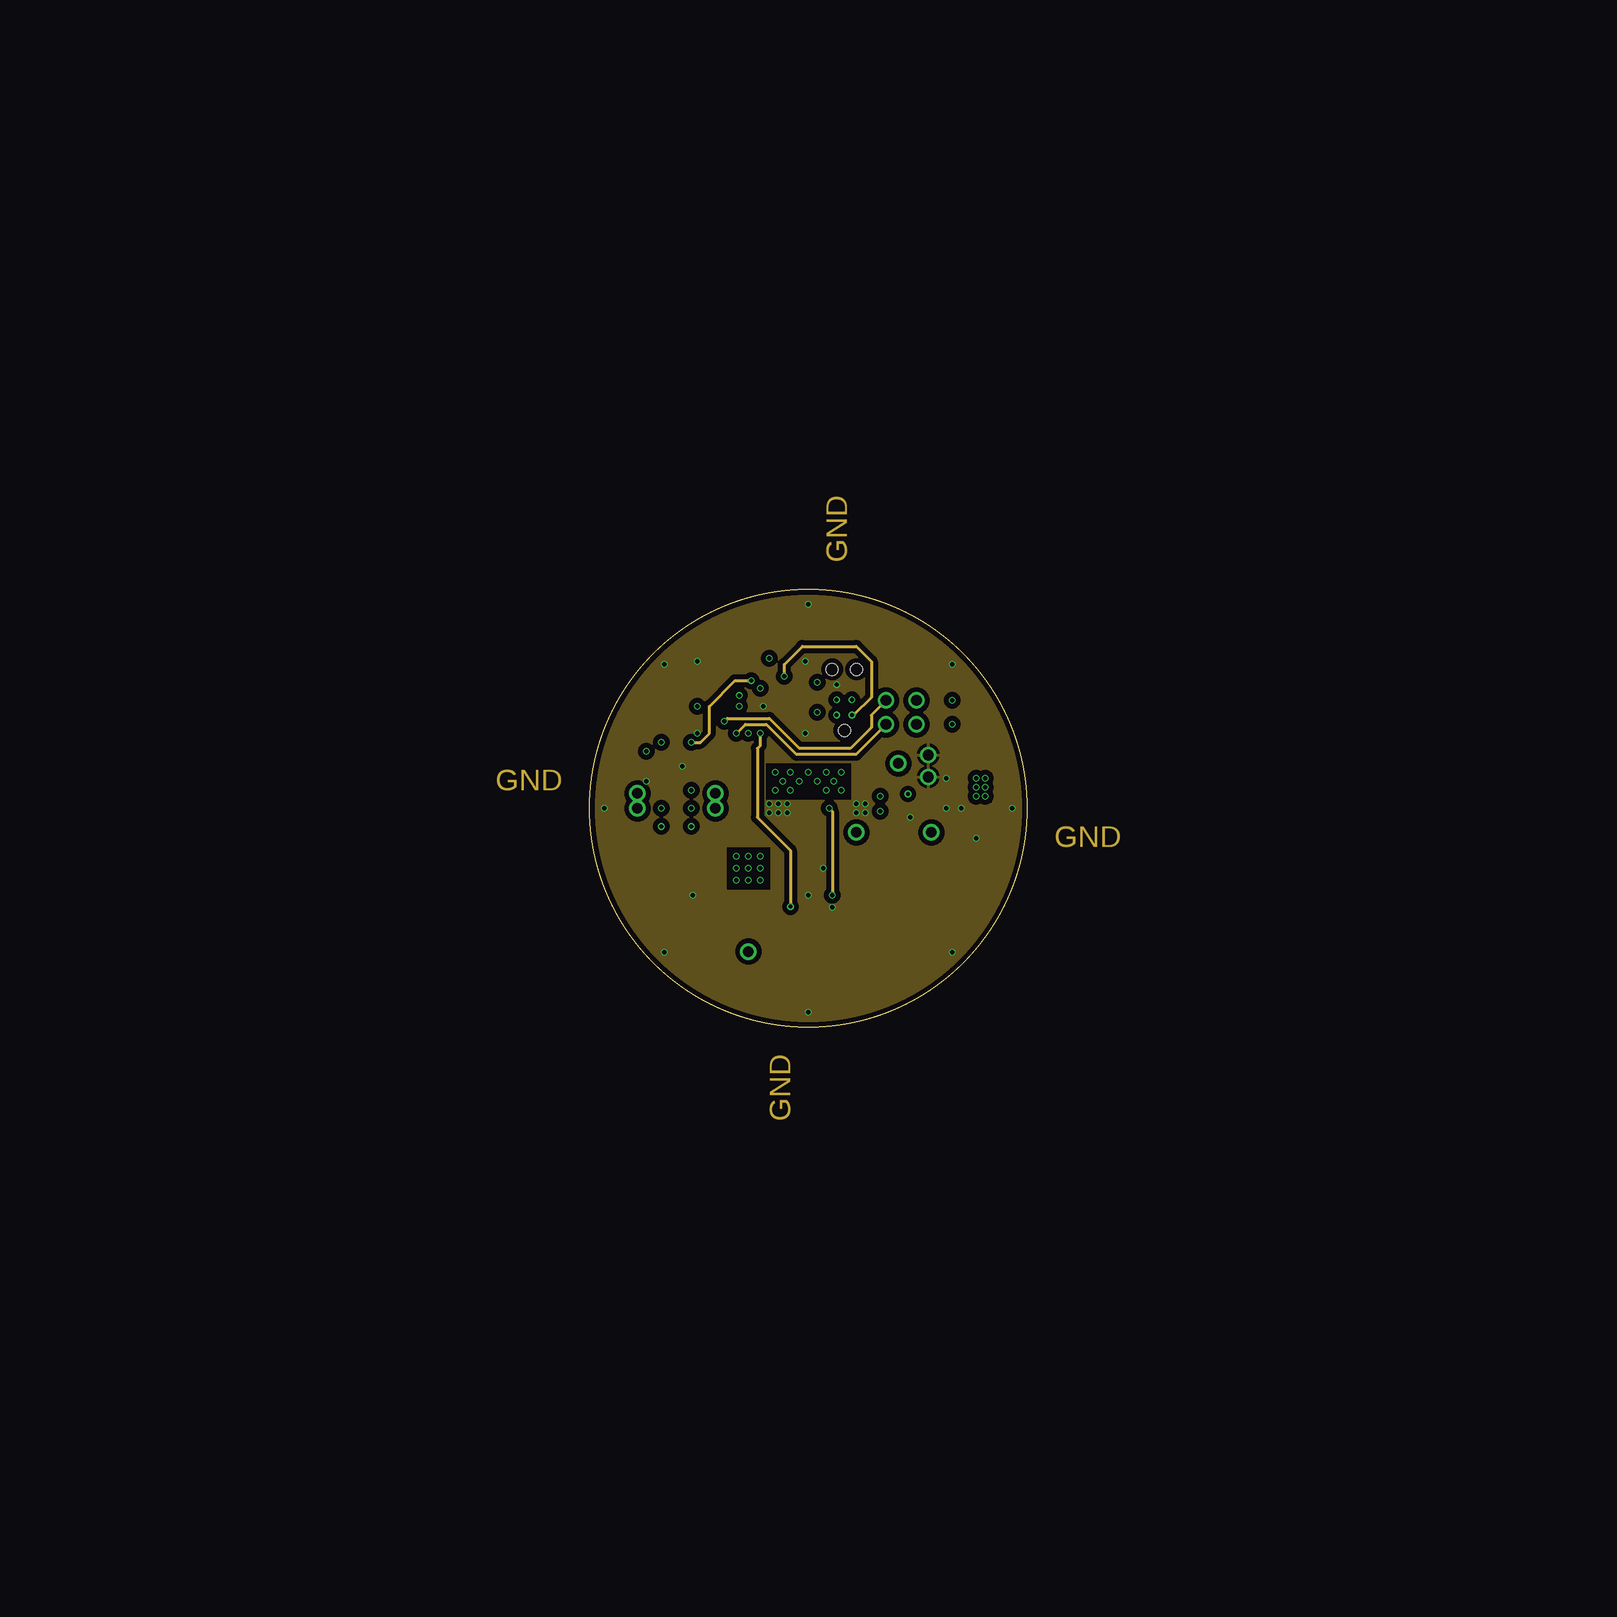
[diagram p9: board, inner layer Route15]
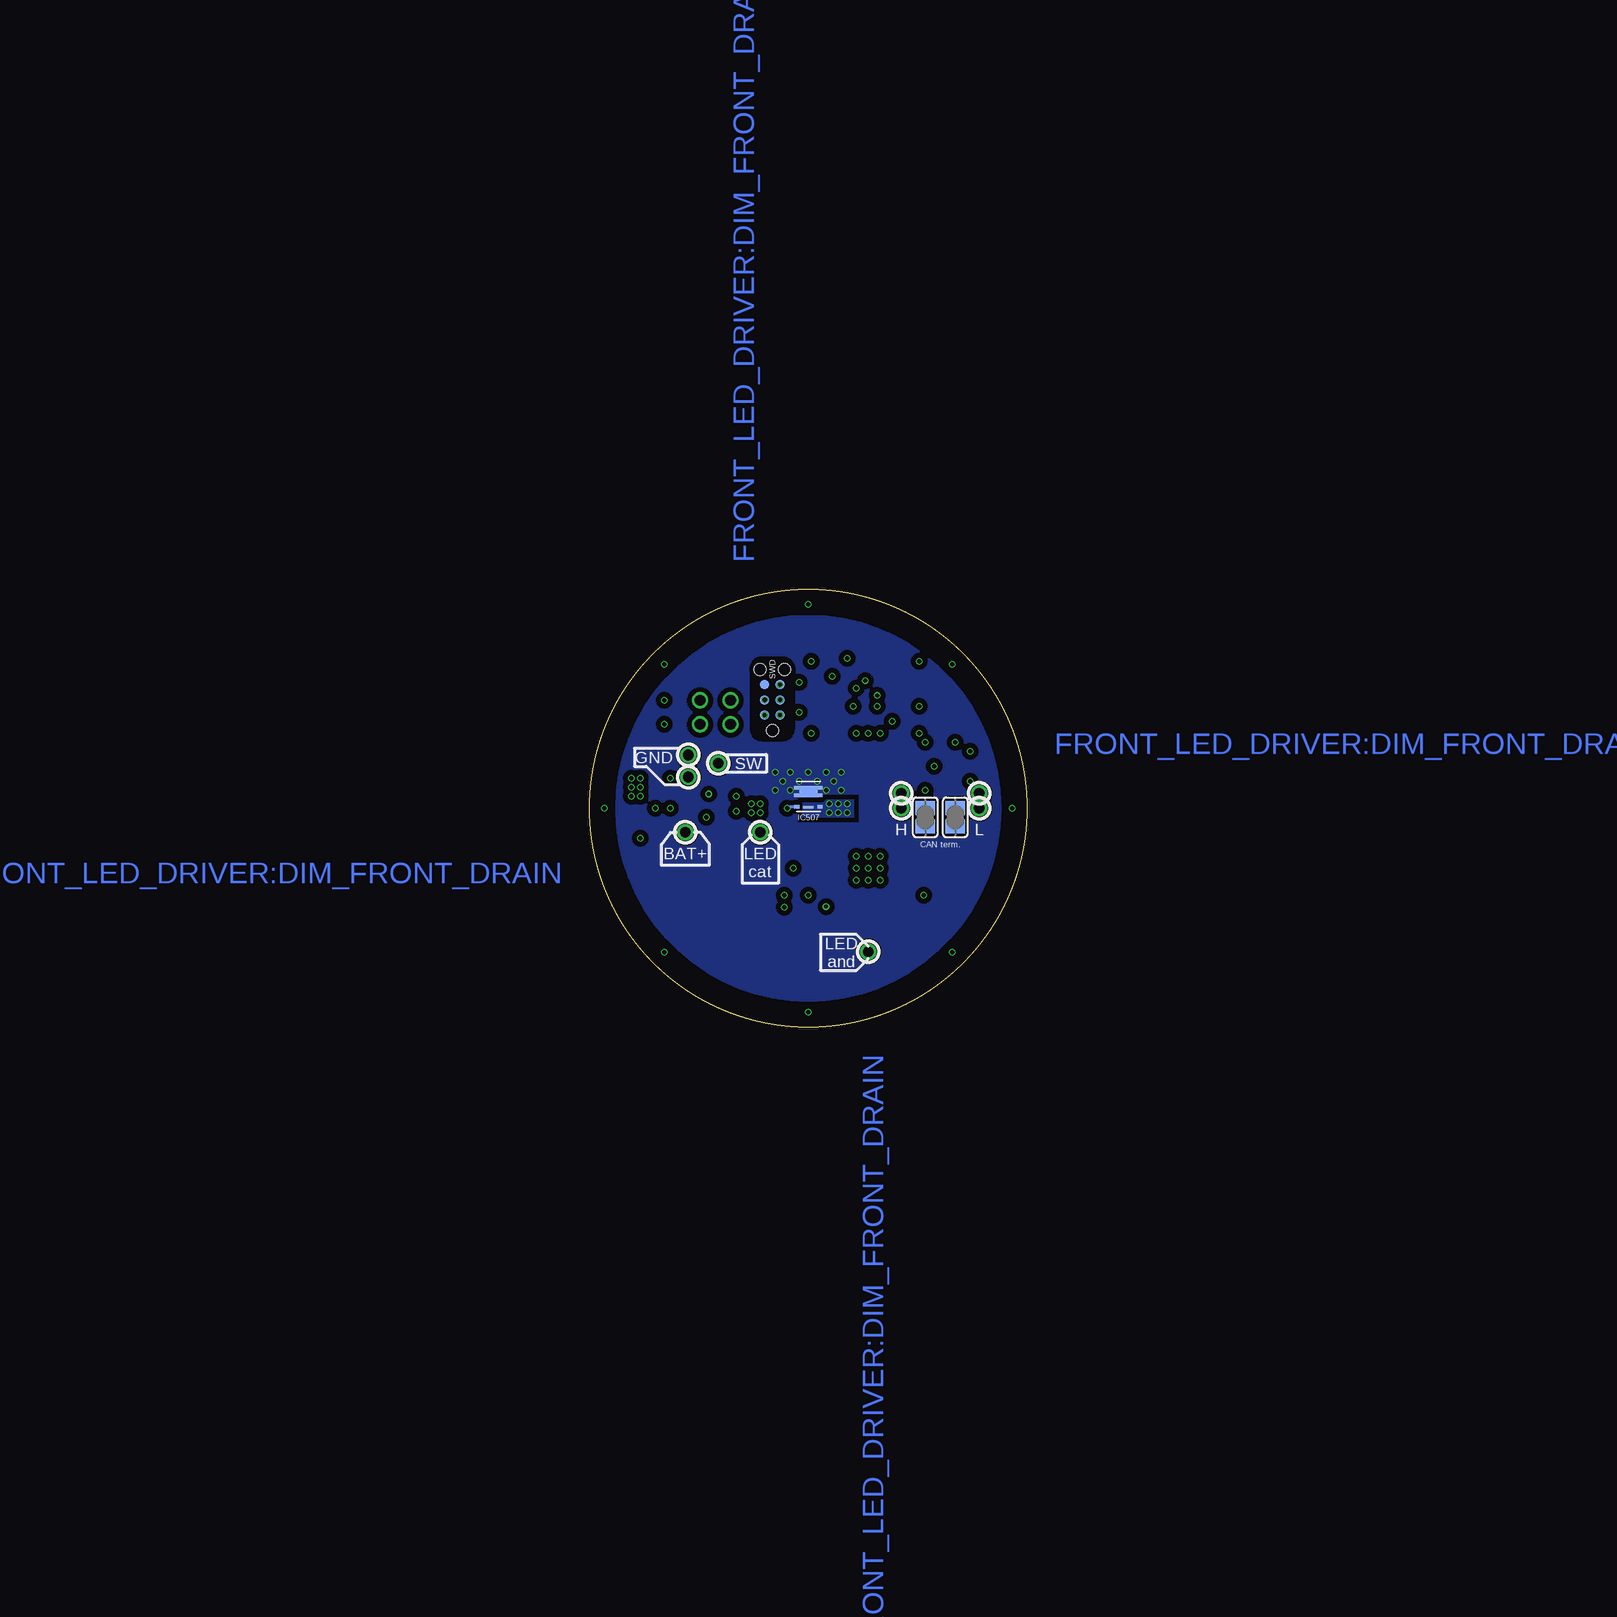
[diagram p10: board, bottom side, seen from below]

Size 36.5 x 36.5 mm. Coordinates in mm from the lower left corner, seen from the top.
Outline: circle at 18.25,18.25 radius 18.25
Copper layers (1*2*15*16): Top 0.035559375mm / dielectric 0.17018125mm / Route2 0.01778125mm / dielectric 47mil / Route15 0.01778125mm / dielectric 0.17018125mm / Bottom 0.035559375mm
Design rules "oshpark-4layer": minimum track width 5mil, minimum drill 10mil, track to track 5mil, track to pad 5mil, pad to pad 5mil, via to via 5mil, smd to smd 5mil, copper to edge 15mil, drill to drill 6mil, minimum pad ring 4mil, minimum via ring 4mil, stop-mask expansion 1.5mil, vias tented up to drill 0mil, thermal gap 10mil
tKeepout: area 1,1 to 35.5,35.5
tRestrict: 2 lines

### Footprints (pad centres in the part's own frame; a part is rotated, then mirrored left to right if it is on the bottom)
C0402 = smd 0.7 x 0.9: 1 -0.65,0; 2 0.65,0
SOD123 = smd 1.4 x 1.4: A 1.9,0; C -1.9,0
SOT-23-5L = smd 0.6 x 1.2: ADJ/NC -0.95,-1.15; EN -0.95,1.15; GND 0,1.15; IN 0.95,1.15; OUT 0.95,-1.15
UFQFPN-28 = smd 0.55 x 0.3: 1_PB8 -2.08,1.5; 7_PA1 -2.08,-1.5; 15_PB1 2.08,-1.5; 21_PA13 2.08,1.5 | smd 0.75 x 0.3: 2_PF0 -1.98,1; 3_PF1 -1.98,0.5; 4_NRST -1.98,0; 5_VDDA -1.98,-0.5; 6_PA0 -1.98,-1; 16_VSS 1.98,-1; 17_VDD 1.98,-0.5; 18_VDDIO2 1.98,0; 19_PA9-[PA11] 1.98,0.5; 20_PA10-[PA12] 1.98,1 | smd 0.3 x 0.55: 8_PA2 -1.5,-2.08; 14_PB0 1.5,-2.08; 22_PA14 1.5,2.08; 28_PB7 -1.5,2.08 | smd 0.3 x 0.75: 9_PA3 -1,-1.98; 10_PA4 -0.5,-1.98; 11_PA5 0,-1.98; 12_PA6 0.5,-1.98; 13_PA7 1,-1.98; 23_PA15 1,1.98; 24_PB3 0.5,1.98; 25_PB4 0,1.98; 26_PB5 -0.5,1.98; 27_PB6 -1,1.98
SOT23-8 = smd 0.45 x 1.1: P$1 -0.975,-1.275; P$2 -0.325,-1.275; P$3 0.325,-1.275; P$4 0.975,-1.275; P$5 0.975,1.275; P$6 0.325,1.275; P$7 -0.325,1.275; P$8 -0.975,1.275
TDFN-6-EP = smd 0.71 x 0.46: CSN -1.48,0; DIM -1.48,-0.94; DRV 1.48,0; GND1 1.48,-0.95; IN -1.48,0.94; VCC 1.48,0.95 | smd 1.5 x 2.3: GND 0,0
SC-70-6 = smd 0.45 x 0.3: 1D -0.975,0.725; 2D -0.975,0.075; 3G -0.975,-0.88; 4S 0.975,-0.88; 5D 0.975,0.075; 6D 0.975,0.725 | smd 1.5 x 0.95: D 0,0.4 | smd 0.87 x 0.23: S 0,-0.915
4SOT143 = smd 0.94 x 1.31: 1_GND -0.76,-1.06 | smd 0.55 x 1.31: 2_IN 0.96,-1.06; 3_OUT 0.96,1.06; 4_VCC -0.96,1.06
SRN6045 = smd 2.5 x 6: 1 -2.175,0; 2 2.125,0
TH = drill 0.9: AND -1.27,0; CAT 1.27,0
R0805 = smd 1.3 x 1.5: 1 -0.95,0; 2 0.95,0
R2010 = smd 1.8 x 2.7: 1 -2.2,0; 2 2.2,0
R0402 = smd 0.6 x 0.7: 1 -0.5,0; 2 0.5,0
SJ = smd 1.168 x 1.6: 1 -0.762,0; 2 0.762,0
TC2030-NL = smd 0.787 x 0.787: 1_TVCC 1.27,-0.635; 2_T_SWDIO 1.27,0.635; 3_T_NRST 2.54,-0.635; 4_T_SWCLK 2.54,0.635; 5_GND 3.81,-0.635; 6_T_SWO 3.81,0.635 | hole 0.991: 0,0; 5.08,-1.016; 5.08,1.016
TH-0.9 = drill 0.9: P$1 0,0

### Placement (x,y rotation side)
C202  1uF / 10V  [C0402]  31,15.75 0 top
C207  1uF / 10V  [C0402]  31,20.74 0 top
C301  0.1uF / 10V  [C0402]  18,25.75 90 top
C304  1uF / 10V  [C0402]  9,25.75 90 top
C305  0.1uF / 10V  [C0402]  18,29.25 270 top
C307  0.1uF / 10V  [C0402]  9,29.25 270 top
C401  47nF / 10V  [C0402]  7.25,11 0 top
C405  0.1uF / 10V  [C0402]  4.75,21.75 270 top
C506  1uF / 10V  [C0402]  18.25,13.25 0 top
D501  PMEG2010ER,115  [SOD123]  13.25,18 90 top
IC202  LDK320AM33R  [SOT-23-5L]  31,18.25 90 top
IC302  STM32F042G6U6  [UFQFPN-28]  13.5,27.75 0 top
IC401  TCAN334  [SOT23-8]  7.25,21.75 180 top
IC506  MAX16820  [TDFN-6-EP]  18.25,11 0 top
IC507  SQA470EEJ-T1_GE3  [SC-70-6]  18.25,19.25 0 bottom
IC602  MAX6816EUS+T  [4SOT143]  25.5,18.25 90 top
L501  VLS6045EX-150M-CA - 15uH  [SRN6045]  18.25,18.25 270 top
LED702  WP7113VRVC1C  [TH]  26,27.25 180 top
LED703  LTL2R3TGY3KS  [TH]  26,25.25 180 top
R401  60R, 0.5W  [R0805]  6,13.75 270 top
R402  60R, 0.5W  [R0805]  8.5,13.75 90 top
R504  0.18R  [R2010]  13.25,10.5 90 top
R701  0R, >120mW  [R0402]  29.25,25.25 180 top
R702  0R, >120mW  [R0402]  29.25,27.25 180 top
SJ401  CAN H term.  [SJ]  8.5,17.5 270 bottom
SJ402  CAN L term.  [SJ]  6,17.5 270 bottom
SWD1  21.25,24.75 90 bottom
TP1  28.5,16.25 90 bottom
TP2  28.25,20.85 180 bottom
TP3  13.25,6.3 0 bottom
TP4  22.25,16.25 0 bottom
TP5  10.5,18.25 0 bottom
TP6  4,18.25 0 bottom
TP7  10.5,19.5 0 bottom
TP8  4,19.5 0 bottom
TP601  LED anode  [TH-0.9]  25.75,22 0 bottom
TP602  LED anode  [TH-0.9]  28.25,22.7 0 bottom

### Tracks (layer width: path | path; a pad name or v marks a point on that pad's centre or on a via)
3V3  (via drill 0.35)
  Top 0.25: IC401.P$3 6.93,22 4.75,22 C405.1 v4.75,23 | IC302.5_VDDA 10.75,27.25 9.9,26.4 C304.2 v9,26.75 | IC302.18_VDDIO2 16.25,27.75 17.1,28.6 C305.2 18.85,28.6 v19,28.75 | IC302.17_VDD 16.25,27.25 17.1,26.4 C301.2 18.85,26.4 v19,26.25 | v32.25,20.75 v32.24,20.74 C207.2 | IC602.4_VCC 24.25,17.48 v24.25,18 | R701.1 v30.25,25.25 | R702.1 v30.25,27.25
  Bottom 0.25: SWD1.1_TVCC v20.61,26.02
  other vias: 33,20.75 33,19.25 32.25,19.25 33,20 32.25,20
  pour Route2 (isolate 0.406, rank 4): 2.25,18.25 arc-90 18.25,34.25 arc-90 34.25,18.25 arc-90 18.25,2.25 arc-90
  pour Top (no thermals): 31.5,21.25 31.5,18.88 33.38,18.88 33.38,21.25
  cutout Route2: 14.25,22 21.75,22 21.75,17.25 14.25,17.25
!STBY!  (via drill 0.35)
  Top 0.25: IC302.11_PA5 13.54,25.73 13.54,25.04 13.25,24.75 v13.25,24.5 | IC401.P$8 8.22,20.02 v8.5,19.75
  Route2 0.25: v13.25,24.5 13.25,23.75 11.75,22.25 10.5,22.25 8.5,20.25 v8.5,19.75
BAT+  (via drill 0.35)
  Top 0.5: IC202.EN 28.75,17.3 28.75,19.2 IC202.IN
  other vias: 12.25,13.25 14.25,13.25 14.25,12.25 12.25,12.25 13.25,13.25 13.25,12.25 12.25,14.25 13.25,14.25 14.25,14.25
  pour Top (no thermals): 11.88,13.5 11.88,14.75 12.62,15.5 13.88,15.5 14.62,14.75 14.62,13.5
  pour Top (no thermals): 17.25,13.75 17.25,12.75 17.12,12.62 17.12,11.75 14.5,11.75 14.5,13.75
  pour Route2 (no thermals): 11.75,14.75 11.75,11.75 22.25,11.75 26,15.5 28.75,15.5 29,15.75 29,16.75 28.75,17 14,17
  pour Top (no thermals): 27.75,17.62 27.75,15.25 30.75,15.25 30.75,17.62
CAN_H  (via drill 0.35)
  Top 0.25: IC401.P$7 7.57,19.16 v8.49,18.25 TP5.P$1 TP7.P$1
  Bottom 0.25: v8.49,18.25 SJ401.1
CAN_INFRA:H  (via drill 0.35)
  Top 0.25: R402.2 SJ401.2
  other vias: 8.5,16.74
CAN_INFRA:L  (via drill 0.35)
  Top 0.25: R401.1 SJ402.2
  other vias: 6,16.74
CAN_INFRA:SPLIT
  pour Top (no thermals): 5.25,13.38 9.25,13.38 9.25,12.12 7,12.12 7,10.5 6.25,10.5 6.25,11.12 5.25,12.12
CAN_L  (via drill 0.35)
  Top 0.25: IC401.P$6 6.93,19.19 SJ402.1 5.99,18.25 TP6.P$1 TP8.P$1
  other vias: 6,18.26
CAN_RX  (via drill 0.35)
  Top 0.25: v14.25,28.25 IC302.19_PA9-[PA11] | IC401.P$4 6.28,23.48 v6,23.75
  Route2 0.25: v14.25,28.25 7.75,28.25 6,26.5 v6,23.75
CAN_TX  (via drill 0.35)
  Top 0.25: IC302.20_PA10-[PA12] 14.84,28.75 14.75,28.84 13.55,28.84 v13.5,28.89 | IC401.P$1 8.22,23.48 v8.5,23.75
  Route15 0.25: v13.5,28.89 12.14,28.89 10,26.75 10,24.5 9.25,23.75 v8.5,23.75
CUT1
  cutout Top: 19.38,29.75 19.38,24.75 arc90 20.38,23.75 22.12,23.75 arc90 23.12,24.75 23.12,29.75 arc90 22.12,30.75 20.38,30.75 arc90
CUT2
  cutout Bottom: 23.12,29.88 23.12,24.88 arc-90 22.12,23.88 20.38,23.88 arc-90 19.38,24.88 19.38,29.88 arc-90 20.38,30.88 22.12,30.88 arc-90
DIM_FRONT  (via drill 0.35)
  Top 0.25: IC302.12_PA6 14,25.02 14.25,24.77 v14.25,24.5
  Route15 0.25: IC506.DIM 16.75,10.08 16.75,14.75 14,17.5 14,23.25 14.25,23.5 v14.25,24.5
  other vias: 16.77,10.06
FRONT_LED_DRIVER:DIM_FRONT_DRAIN  (via drill 0.35)
  other vias: 15.5,21.25 15.5,19.75 21,21.25 21,19.75 18.25,21.25 16.75,21.25 19.75,21.25 16.75,19.75 19.75,19.75 16.12,20.5 17.5,20.5 19,20.5 20.38,20.5
  pour Bottom (isolate 0.406, rank 3, no thermals): 2.25,18.25 arc-90 18.25,34.25 arc-90 34.25,18.25 arc-90 18.25,2.25 arc-90
  pour Top (no thermals): 15.5,19.12 13.75,19.12 13.75,20.38 15,21.62 15.5,21.62
FRONT_LED_DRIVER:DIM_FRONT_GATE  (via drill 0.35)
  Top 0.25: v20.25,11 IC506.DRV
  Route15 0.25: v20.25,11 20.25,18 v20,18.25
  Bottom 0.25: v20,18.25 19.88,18.37 IC507.3G
GND  (via drill 0.35)
  other vias: 7.75,21.75 31,18.25 32.25,15.75 29.75,20.75 8.62,11 26.75,17.5 4.75,20.5 20.62,28.56 14.5,26.75 19.5,13.25 18.25,11 18,30.5 18,24.5 9,30.5 9,24.5 16.5,18.62 16.5,17.88 15.75,18.62 15.75,17.88 15,17.88 15,18.62 18.25,35.25 35.25,18.25 1.25,18.25 18.25,1.25 6.25,30.25 30.25,30.25 30.25,6.25 6.25,6.25 20.25,10 22.25,18.62 22.25,17.88 23,17.88 23,18.62 29.75,18.25
  pour Top (rank 3): 0.25,18.25 arc-90 18.25,36.25 arc-90 36.25,18.25 arc-90 18.25,0.25 arc-90
  pour Route15 (isolate 0.406): 0.25,18.25 arc-90 18.25,36.25 arc-90 36.25,18.25 arc-90 18.25,0.25 arc-90
  pour Bottom (no thermals): 18.68,18.75 17,18.75 16.75,19 14.5,19 14.5,17.5 18.68,17.5
  cutout Route15: 14.75,22 21.75,22 21.75,19 14.75,19
  cutout Route15: 11.5,15 15,15 15,11.5 11.5,11.5
  cutout Route15: 31.75,21.25 33.5,21.25 33.5,18.75 31.75,18.75
GREEN  (via drill 0.35)
  Top 0.25: IC302.10_PA4 12.96,25.73 12.96,25.27 12.25,24.55 v12.25,24.5
  Route15 0.25: v12.25,24.5 13,25.25 14.75,25.25 17.25,22.75 22.23,22.75 LED703.CAT
LED_AN
  Top 0.5: R504.1 13.25,9.75 14.5,11 IC506.CSN
  pour Top (no thermals): 11.75,7.5 11.75,6.75 12.75,5.75 13.75,5.75 14.75,6.75 14.75,7.5
LED_CA
  pour Top (no thermals): 21,17.38 22.25,17.38 23,16.62 23,15.75 22.12,14.88 21,14.88
PUSHBUTTON:SWITCH_IN  (via drill 0.35)
  Top 0.25: IC602.2_IN v26.56,19.44 26.56,21.19 TP601.P$1
RED  (via drill 0.35)
  Top 0.25: IC302.8_PA2 11.83,25.5 v11.25,25.5
  Route15 0.25: v11.25,25.5 11.5,25.75 15,25.75 17.5,23.25 21.75,23.25 23.5,25 23.5,26.02 LED702.CAT
SWITCH  (via drill 0.35)
  Top 0.25: IC302.6_PA0 v12.5,26.75 | IC602.3_OUT 24.29,19.21 v24.25,19.25
  Route2 0.25: v24.25,19.25 24.25,20.5 22.25,22.5 18.25,22.5 14.75,26 13.25,26 v12.5,26.75
SYS_NRST  (via drill 0.35)
  Top 0.25: C307.2 9.9,28.6 10.75,27.75 IC302.4_NRST 12.41,27.75 v12.5,27.66
  Route2 0.25: v12.5,27.66 20.24,27.66 v20.61,27.29
  Bottom 0.25: SWD1.3_T_NRST v20.61,27.29
SYS_SWCLK  (via drill 0.35)
  Top 0.25: IC302.22_PA14 v15,30.75
  Route2 0.25: v15,30.75 16.08,31.83 21.92,31.83 23.38,30.37 23.38,28.79 SWD1.4_T_SWCLK
  other vias: 21.88,27.29
SYS_SWDIO  (via drill 0.35)
  Top 0.25: IC302.21_PA13 v16.25,29.25
  Route15 0.25: v16.25,29.25 16.25,30.25 17.75,31.75 22.25,31.75 23.5,30.5 23.5,27.5 22.02,26.02 v21.89,26.02
  Bottom 0.25: SWD1.2_T_SWDIO v21.89,26.02
USER_LED:GREEN_AND
  Top 0.25: LED703.AND R701.2
USER_LED:RED_AND
  Top 0.25: LED702.AND R702.2

### Text on the board
Top: GND | GND | GND | GND
Route2: 3V3 | 3V3 | 3V3 | 3V3
Route15: GND | GND | GND | GND
Bottom: FRONT_LED_DRIVER:DIM_FRONT_DRAIN | FRONT_LED_DRIVER:DIM_FRONT_DRAIN | FRONT_LED_DRIVER:DIM_FRONT_DRAIN | FRONT_LED_DRIVER:DIM_FRONT_DRAIN
bPlace: SW | GND | L | H | CAN term. | LED / cat | BAT+ | LED / and
bStop: MJ-808 clone / SuperNova E3 / ejovrh rev. 5a
Document: SuperNova E3 housing